# Altium project SJA1105Q_LAN8870_EVB_revA.PrjPcb (part 2 of 2)

## Sheet LAN8870_PINOUT.SchDoc
size C; SheetNumber: 3; SheetTotal: 7
Used 4 times, as channels PHY_1, PHY_2, PHY_3, PHY_4. Parts and nets are listed once, with the designators drawn on the sheet.
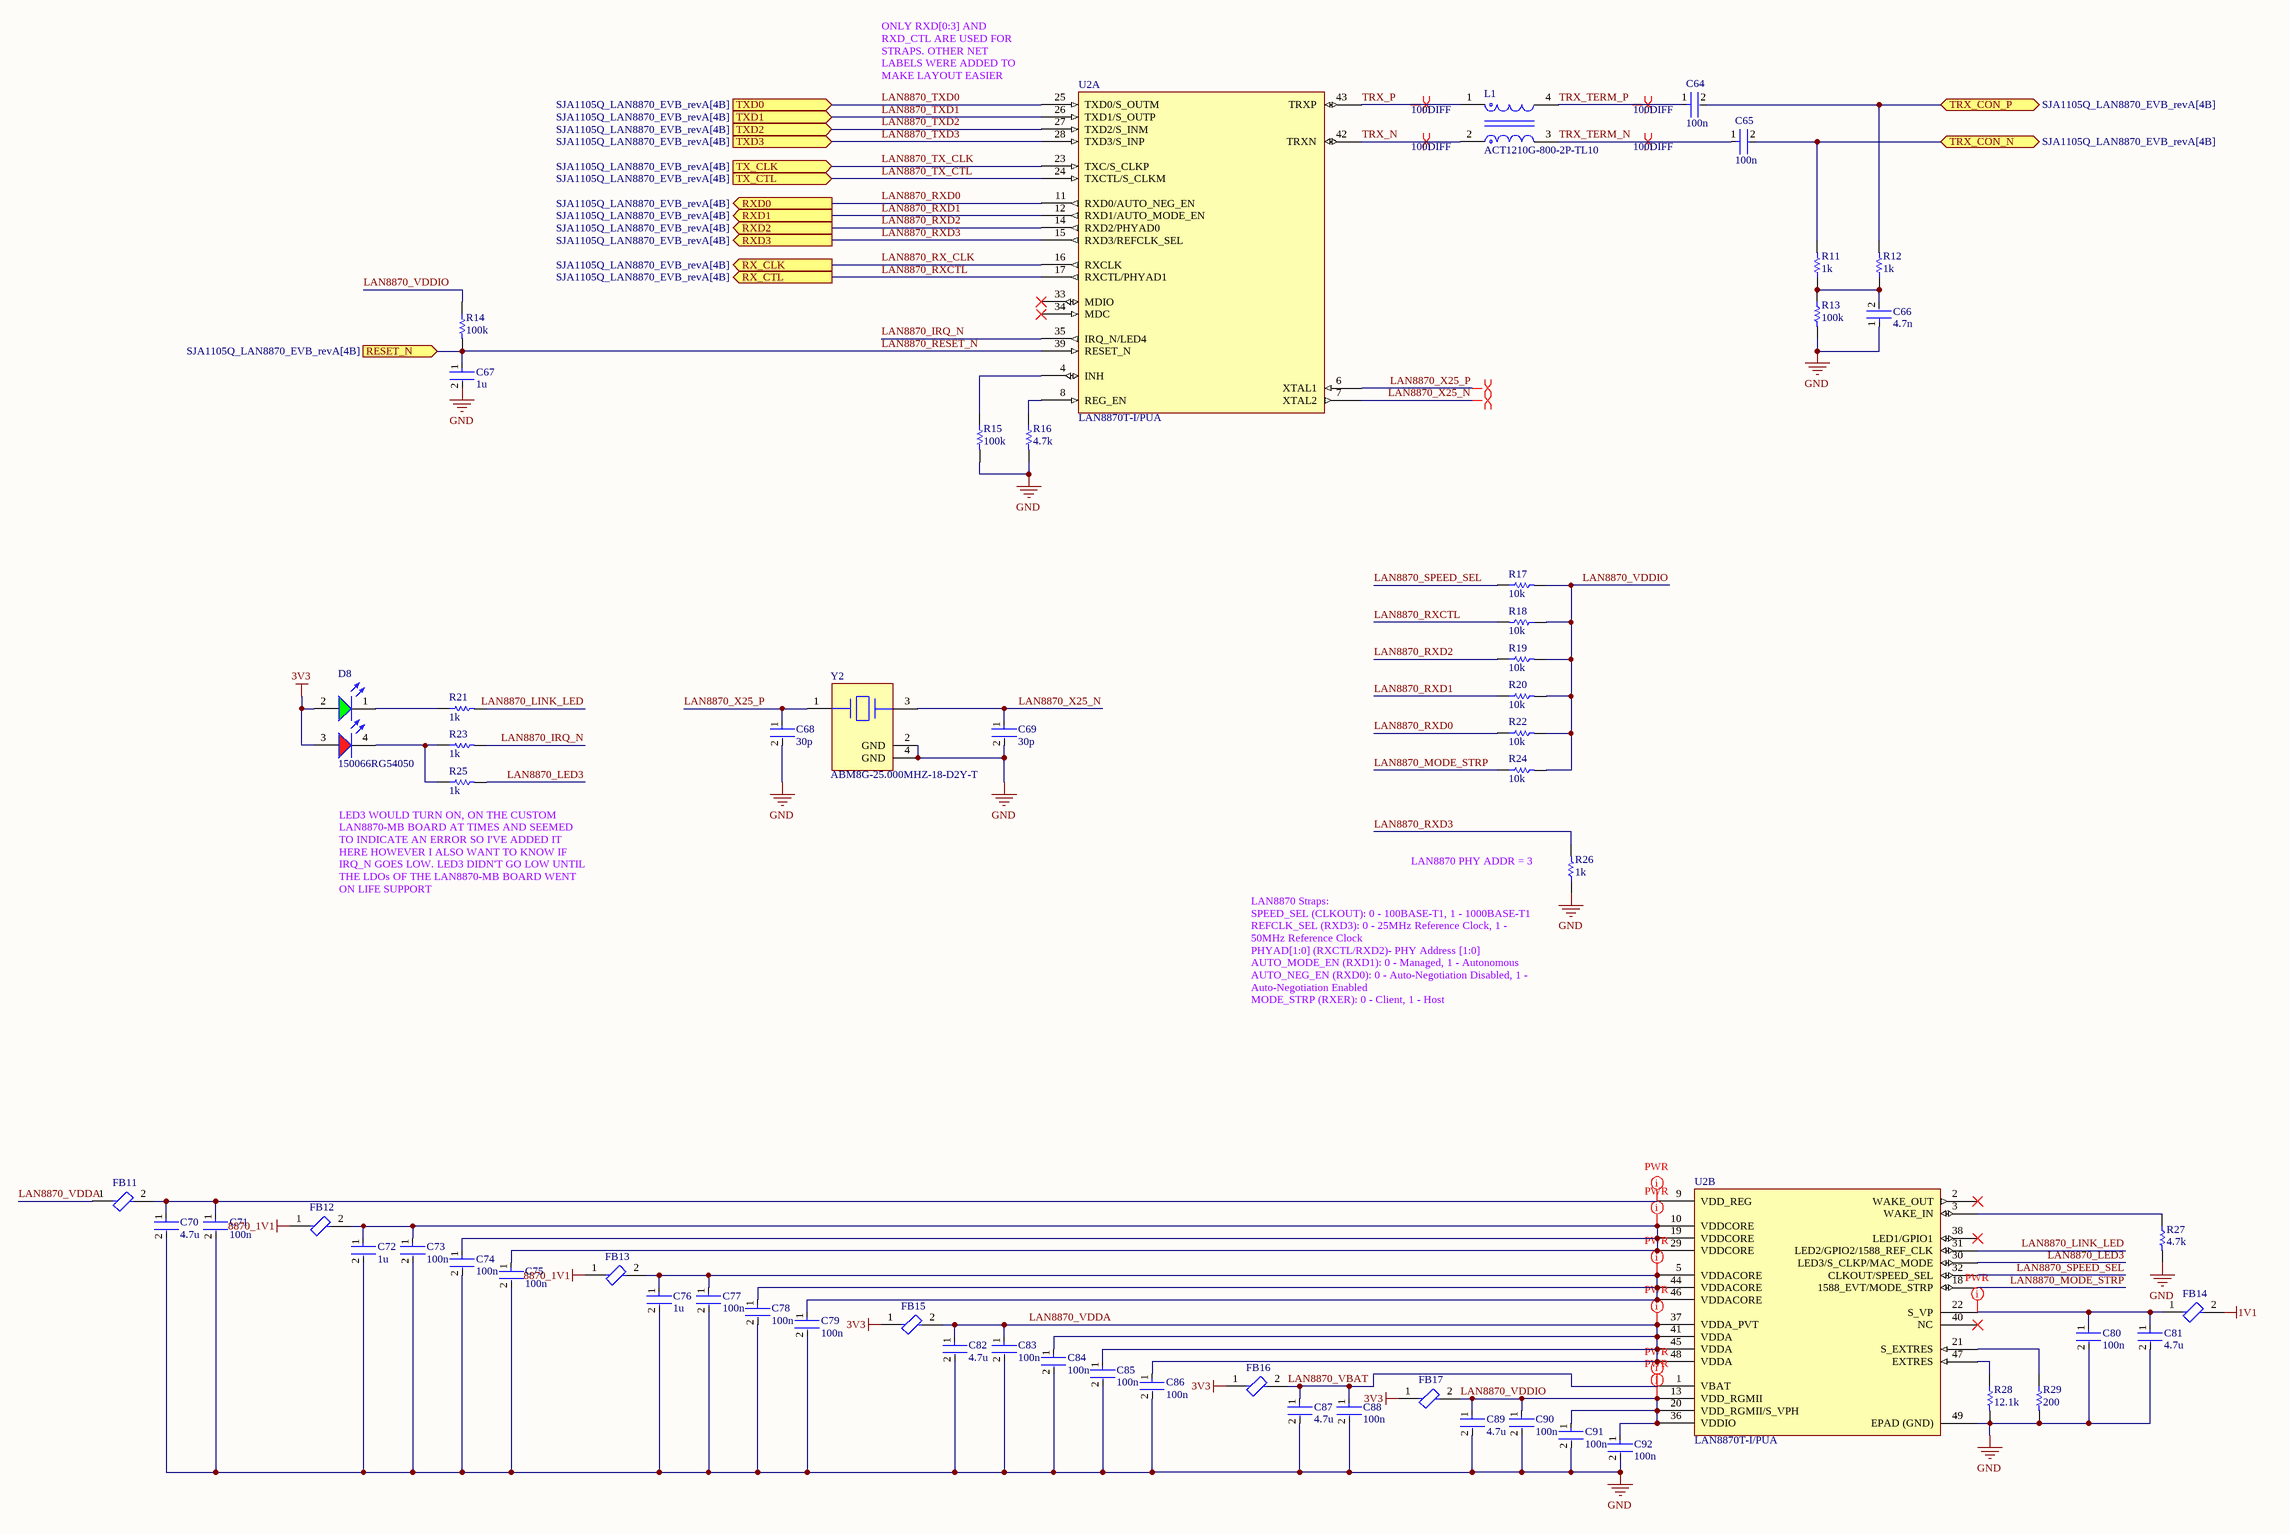
[diagram p8: LAN8870_PINOUT.SchDoc]

### Parts
C64  100n  [FP-0402-L_1_0_0_05-W_0_5-IPC_A]
C65  100n  [FP-0402-L_1_0_0_05-W_0_5-IPC_A]
C66  4.7n  [FP-0402-L_1_0_0_05-W_0_5-IPC_A]
C67  1u  [FP-0402-L_1_0_0_05-W_0_5-IPC_A]
C68  30p  [FP-0402-L_1_0_0_05-W_0_5-IPC_A]
C69  30p  [FP-0402-L_1_0_0_05-W_0_5-IPC_A]
C70  4.7u  [FP-0402-L_1_0_0_05-W_0_5-IPC_A]
C71  100n  [FP-0402-L_1_0_0_05-W_0_5-IPC_A]
C72  1u  [FP-0402-L_1_0_0_05-W_0_5-IPC_A]
C73  100n  [FP-0402-L_1_0_0_05-W_0_5-IPC_A]
C74  100n  [FP-0402-L_1_0_0_05-W_0_5-IPC_A]
C75  100n  [FP-0402-L_1_0_0_05-W_0_5-IPC_A]
C76  1u  [FP-0402-L_1_0_0_05-W_0_5-IPC_A]
C77  100n  [FP-0402-L_1_0_0_05-W_0_5-IPC_A]
C78  100n  [FP-0402-L_1_0_0_05-W_0_5-IPC_A]
C79  100n  [FP-0402-L_1_0_0_05-W_0_5-IPC_A]
C80  100n  [FP-0402-L_1_0_0_05-W_0_5-IPC_A]
C81  4.7u  [FP-0402-L_1_0_0_05-W_0_5-IPC_A]
C82  4.7u  [FP-0402-L_1_0_0_05-W_0_5-IPC_A]
C83  100n  [FP-0402-L_1_0_0_05-W_0_5-IPC_A]
C84  100n  [FP-0402-L_1_0_0_05-W_0_5-IPC_A]
C85  100n  [FP-0402-L_1_0_0_05-W_0_5-IPC_A]
C86  100n  [FP-0402-L_1_0_0_05-W_0_5-IPC_A]
C87  4.7u  [FP-0402-L_1_0_0_05-W_0_5-IPC_A]
C88  100n  [FP-0402-L_1_0_0_05-W_0_5-IPC_A]
C89  4.7u  [FP-0402-L_1_0_0_05-W_0_5-IPC_A]
C90  100n  [FP-0402-L_1_0_0_05-W_0_5-IPC_A]
C91  100n  [FP-0402-L_1_0_0_05-W_0_5-IPC_A]
C92  100n  [FP-0402-L_1_0_0_05-W_0_5-IPC_A]
D8  150066RG54050  [WL-SBCD_0606]
FB11  BLM18KG331SH1D  [FP-BLM18-0_15-t0_8-IPC_B]  (value not drawn)
FB12  BLM18KG331SH1D  [FP-BLM18-0_15-t0_8-IPC_B]  (value not drawn)
FB13  BLM18KG331SH1D  [FP-BLM18-0_15-t0_8-IPC_B]  (value not drawn)
FB14  BLM18KG331SH1D  [FP-BLM18-0_15-t0_8-IPC_B]  (value not drawn)
FB15  BLM18KG331SH1D  [FP-BLM18-0_15-t0_8-IPC_B]  (value not drawn)
FB16  BLM18KG331SH1D  [FP-BLM18-0_15-t0_8-IPC_B]  (value not drawn)
FB17  BLM18KG331SH1D  [FP-BLM18-0_15-t0_8-IPC_B]  (value not drawn)
L1  ACT1210G-800-2P-TL10  [FP-ACT1210G-800-2P-TL10-MFG]
R11  1k  [R0603B]
R12  1k  [R0603B]
R13  100k  [R0603B]
R14  100k  [R0603B]
R15  100k  [R0603B]
R16  4.7k  [R0603B]
R17  10k  [R0603B]
R18  10k  [R0603B]
R19  10k  [R0603B]
R20  10k  [R0603B]
R21  1k  [R0603B]
R22  10k  [R0603B]
R23  1k  [R0603B]
R24  10k  [R0603B]
R25  1k  [R0603B]
R26  1k  [R0603B]
R27  4.7k  [R0603B]
R28  12.1k  [R0603B]
R29  200  [R0603B]
U2  LAN8870T-I/PUA  [QFN50P700X700X100_HS-49N]  (parts A,B of 2)
Y2  ABM8G-25.000MHZ-18-D2Y-T  [FP-ABM8G-MFG]

### Ports
RESET_N (in, see SJA1105Q_LAN8870_EVB_revA[4B]), RX_CLK (out, see SJA1105Q_LAN8870_EVB_revA[4B]), RX_CTL (out, see SJA1105Q_LAN8870_EVB_revA[4B]), RXD0 (out, see SJA1105Q_LAN8870_EVB_revA[4B]), RXD1 (out, see SJA1105Q_LAN8870_EVB_revA[4B]), RXD2 (out, see SJA1105Q_LAN8870_EVB_revA[4B]), RXD3 (out, see SJA1105Q_LAN8870_EVB_revA[4B]), TRX_CON_N (bidir, see SJA1105Q_LAN8870_EVB_revA[4B]), TRX_CON_P (bidir, see SJA1105Q_LAN8870_EVB_revA[4B]), TX_CLK (in, see SJA1105Q_LAN8870_EVB_revA[4B]), TX_CTL (in, see SJA1105Q_LAN8870_EVB_revA[4B]), TXD0 (in, see SJA1105Q_LAN8870_EVB_revA[4B]), TXD1 (in, see SJA1105Q_LAN8870_EVB_revA[4B]), TXD2 (in, see SJA1105Q_LAN8870_EVB_revA[4B]), TXD3 (in, see SJA1105Q_LAN8870_EVB_revA[4B])

### Nets
1V1: FB14.2
3V3: D8.2(A) D8.3(A) FB15.1 FB16.1 FB17.1
8870_1V1: FB12.1 FB13.1
GND: C66.1 C67.2 C68.2 C69.2 C70.2 C71.2 C72.2 C73.2 C74.2 C75.2 C76.2 C77.2 C78.2 C79.2 C80.2 C81.2 C82.2 C83.2 C84.2 C85.2 C86.2 C87.2 C88.2 C89.2 C90.2 C91.2 C92.2 R13.2 R15.2 R16.2 R26.1 R27.2 R28.2 R29.2 U2.49(EPAD_(GND)) Y2.2(GND) Y2.4(GND)
LAN8870_IRQ_N: R23.2 U2.35(IRQ_N/LED4)
LAN8870_LED3: R25.2 U2.30(LED3/S_CLKP/MAC_MODE)
LAN8870_LINK_LED: R21.2 U2.31(LED2/GPIO2/1588_REF_CLK)
LAN8870_MODE_STRP: R24.1 U2.18(1588_EVT/MODE_STRP)
LAN8870_RESET_N: C67.1 R14.2 U2.39(RESET_N) ; port RESET_N
LAN8870_RX_CLK: U2.16(RXCLK) ; port RX_CLK
LAN8870_RXCTL: R18.2 U2.17(RXCTL/PHYAD1) ; port RX_CTL
LAN8870_RXD0: R22.1 U2.11(RXD0/AUTO_NEG_EN) ; port RXD0
LAN8870_RXD1: R20.1 U2.12(RXD1/AUTO_MODE_EN) ; port RXD1
LAN8870_RXD2: R19.1 U2.14(RXD2/PHYAD0) ; port RXD2
LAN8870_RXD3: R26.2 U2.15(RXD3/REFCLK_SEL) ; port RXD3
LAN8870_SPEED_SEL: R17.1 U2.32(CLKOUT/SPEED_SEL)
LAN8870_TX_CLK: U2.23(TXC/S_CLKP) ; port TX_CLK
LAN8870_TX_CTL: U2.24(TXCTL/S_CLKM) ; port TX_CTL
LAN8870_TXD0: U2.25(TXD0/S_OUTM) ; port TXD0
LAN8870_TXD1: U2.26(TXD1/S_OUTP) ; port TXD1
LAN8870_TXD2: U2.27(TXD2/S_INM) ; port TXD2
LAN8870_TXD3: U2.28(TXD3/S_INP) ; port TXD3
LAN8870_VBAT: C87.1 C88.1 FB16.2 U2.1(VBAT)
LAN8870_VDDA: C82.1 C83.1 C84.1 C85.1 C86.1 FB11.1 FB15.2 U2.37(VDDA_PVT) U2.41(VDDA) U2.45(VDDA) U2.48(VDDA)
LAN8870_VDDIO: C89.1 C90.1 C91.1 C92.1 FB17.2 R14.1 R17.2 R18.1 R19.2 R20.2 R22.2 R24.2 U2.13(VDD_RGMII) U2.20(VDD_RGMII/S_VPH) U2.36(VDDIO)
LAN8870_X25_N: C69.1 U2.7(XTAL2) Y2.3
LAN8870_X25_P: C68.1 U2.6(XTAL1) Y2.1
TRX_CON_N: C65.2 R11.2 ; port TRX_CON_N
TRX_CON_P: C64.2 R12.2 ; port TRX_CON_P
TRX_N: L1.2 U2.42(TRXN)
TRX_P: L1.1 U2.43(TRXP)
TRX_TERM_N: C65.1 L1.3
TRX_TERM_P: C64.1 L1.4
NetC66_2: C66.2 R11.1 R12.1 R13.1
NetC70_1: C70.1 C71.1 FB11.2 U2.9(VDD_REG)
NetC72_1: C72.1 C73.1 C74.1 C75.1 FB12.2 U2.10(VDDCORE) U2.19(VDDCORE) U2.29(VDDCORE)
NetC76_1: C76.1 C77.1 C78.1 C79.1 FB13.2 U2.5(VDDACORE) U2.44(VDDACORE) U2.46(VDDACORE)
NetC80_1: C80.1 C81.1 FB14.1 U2.22(S_VP)
NetD8_1: D8.1(K) R21.1
NetD8_4: D8.4(K) R23.1 R25.1
NetR15_1: R15.1 U2.4(INH)
NetR16_1: R16.1 U2.8(REG_EN)
NetR27_1: R27.1 U2.3(WAKE_IN)
NetR28_1: R28.1 U2.47(EXTRES)
NetR29_1: R29.1 U2.21(S_EXTRES)

Not connected (* = marked no-connect by the designer): U2 2(WAKE_OUT)* 33(MDIO)* 34(MDC)* 38(LED1/GPIO1)* 40(NC)*

### Channels
PHY_1: designators end in _PHY_1; ports RESET_N=3V3_LAN8870_0_nRST RX_CLK=LAN8870_RX_CLK RX_CTL=LAN8870_RXCTL RXD0=LAN8870_RXD0 RXD1=LAN8870_RXD1 RXD2=LAN8870_RXD2 RXD3=LAN8870_RXD3 TRX_CON_N=P1_TRX_N TRX_CON_P=P1_TRX_P TX_CLK=LAN8870_TX_CLK TX_CTL=LAN8870_TX_CTL TXD0=LAN8870_TXD0 TXD1=LAN8870_TXD1 TXD2=LAN8870_TXD2 TXD3=LAN8870_TXD3
PHY_2: designators end in _PHY_2; ports RESET_N=3V3_LAN8870_1_nRST RX_CLK=LAN8870_RX_CLK RX_CTL=LAN8870_RXCTL RXD0=LAN8870_RXD0 RXD1=LAN8870_RXD1 RXD2=LAN8870_RXD2 RXD3=LAN8870_RXD3 TRX_CON_N=P2_TRX_N TRX_CON_P=P2_TRX_P TX_CLK=LAN8870_TX_CLK TX_CTL=LAN8870_TX_CTL TXD0=LAN8870_TXD0 TXD1=LAN8870_TXD1 TXD2=LAN8870_TXD2 TXD3=LAN8870_TXD3
PHY_3: designators end in _PHY_3; ports RESET_N=3V3_LAN8870_2_nRST RX_CLK=LAN8870_RX_CLK RX_CTL=LAN8870_RXCTL RXD0=LAN8870_RXD0 RXD1=LAN8870_RXD1 RXD2=LAN8870_RXD2 RXD3=LAN8870_RXD3 TRX_CON_N=P3_TRX_N TRX_CON_P=P3_TRX_P TX_CLK=LAN8870_TX_CLK TX_CTL=LAN8870_TX_CTL TXD0=LAN8870_TXD0 TXD1=LAN8870_TXD1 TXD2=LAN8870_TXD2 TXD3=LAN8870_TXD3
PHY_4: designators end in _PHY_4; ports RESET_N=3V3_LAN8870_3_nRST RX_CLK=LAN8870_RX_CLK RX_CTL=LAN8870_RXCTL RXD0=LAN8870_RXD0 RXD1=LAN8870_RXD1 RXD2=LAN8870_RXD2 RXD3=LAN8870_RXD3 TRX_CON_N=P4_TRX_N TRX_CON_P=P4_TRX_P TX_CLK=LAN8870_TX_CLK TX_CTL=LAN8870_TX_CTL TXD0=LAN8870_TXD0 TXD1=LAN8870_TXD1 TXD2=LAN8870_TXD2 TXD3=LAN8870_TXD3

### Layout directives
differential pair; differential pair class 100DIFF: TRX_N_PHY_1, TRX_P_PHY_1, TRX_TERM_N_PHY_1, TRX_TERM_P_PHY_1
differential pair: LAN8870_X25_N_PHY_1, LAN8870_X25_P_PHY_1
net class PWR: LAN8870_VBAT_PHY_1, LAN8870_VDDA_PHY_1, LAN8870_VDDIO_PHY_1, NetC70_PHY_1_1, NetC72_PHY_1_1, NetC76_PHY_1_1, NetC80_PHY_1_1

### Notes on the sheet
- ONLY RXD[0:3] AND RXD_CTL ARE USED FOR STRAPS. OTHER NET LABELS WERE ADDED TO MAKE LAYOUT EASIER
- LAN8870 PHY ADDR = 3
- (near R25) LED3 WOULD TURN ON, ON THE CUSTOM LAN8870-MB BOARD AT TIMES AND SEEMED TO INDICATE AN ERROR SO I'VE ADDED IT HERE HOWEVER I ALSO WANT TO KNOW IF IRQ_N GOES LOW. LED3 DIDN'T GO LOW UNTIL THE LDOs OF THE LAN8870-MB BOARD WENT ON LIFE SUPPORT
- (near R26) LAN8870 Straps:
  SPEED_SEL (CLKOUT): 0 - 100BASE-T1, 1 - 1000BASE-T1
  REFCLK_SEL (RXD3): 0 - 25MHz Reference Clock, 1 - 50MHz Reference Clock
  PHYAD[1:0] (RXCTL/RXD2)- PHY Address [1:0]
  AUTO_MODE_EN (RXD1): 0 - Managed, 1 - Autonomous
  AUTO_NEG_EN (RXD0): 0 - Auto-Negotiation Disabled, 1 - Auto-Negotiation Enabled
  MODE_STRP (RXER): 0 - Client, 1 - Host

### Library data of the parts
C64-C92 = CMP-001-00058-1: as C1 on sheet SJA1105Q_LAN8870_EVB_revA; Min Operating Temperature: -55°C; Mounting Technology: Surface Mount; Pins: 2; Case/Package: 0402; RoHS Compliant: Yes; Max Operating Temperature: 85°C
D8 = CMP-004-00040-2: Led, Red/Grn, 180Mcd/230Mcd, 624Nm/525Nm Rohs Compliant: Yes; Source: rgled.SchLib; Component Type: Standard; Design Item ID: CMP-004-00034-2; Pins: 4
FB11-FB17 = CMP-06046-002069-1: as FB1 on sheet SJA1105Q_PINOUT; Packaging: Tape and Reel; Case/Package: 0603; Height: 0.037inch; Case Code (Metric): 1608; Length: 0.063inch; Package Quantity: 4000; Max Operating Temperature: 125°C; Case Code (Imperial): 0603; RoHS Compliant: Yes; Width: 0.032inch; Mount: Surface Mount; Min Operating Temperature: -55°C; Ratings: AEC-Q200; Max Current Rating: 1.7A
L1 = CMP-08256-000023-1: CMC 80UH 70MA 2LN 3.8KOHM SMD
R11 R12 R16-R29 = CMP-009-00002-14: Resistor; Value: 100k
R13-R15 = CMP-009-00002-14: Resistor; Value: 100k
U2 = CMP-015-00023-5: 100/1000BASE-T1 Rgmii/sgmii Phy; Case/Package: VQFN; Pins: 48
Y2 = CMP-2000-05733-3: as Y1 on sheet SJA1105Q_PINOUT; Length: 3.2mm; Depth: 2.5mm; Packaging: Tape and Reel; Min Operating Temperature: -40°C; Operating Frequency: 25 MHz; Lead Free: Lead Free; Number of Pins: 4; Frequency Tolerance: 20ppm; Radiation Hardening: No; Max Operating Temperature: 85°C; Termination: SMD/SMT; Frequency Stability: 30ppm; Frequency: 25MHz; Series: ABM8G; Mount: Surface Mount; Package Quantity: 1000; Height: 0.039inch; Width: 0.098inch; Case/Package: CSMD; ESR (Equivalent Series Resistance): 60R; Load Capacitance: 18pF; Tolerance: 20ppm

## Sheet LAN8830_PINOUT.SchDoc
size C; SheetNumber: 4; SheetTotal: 7
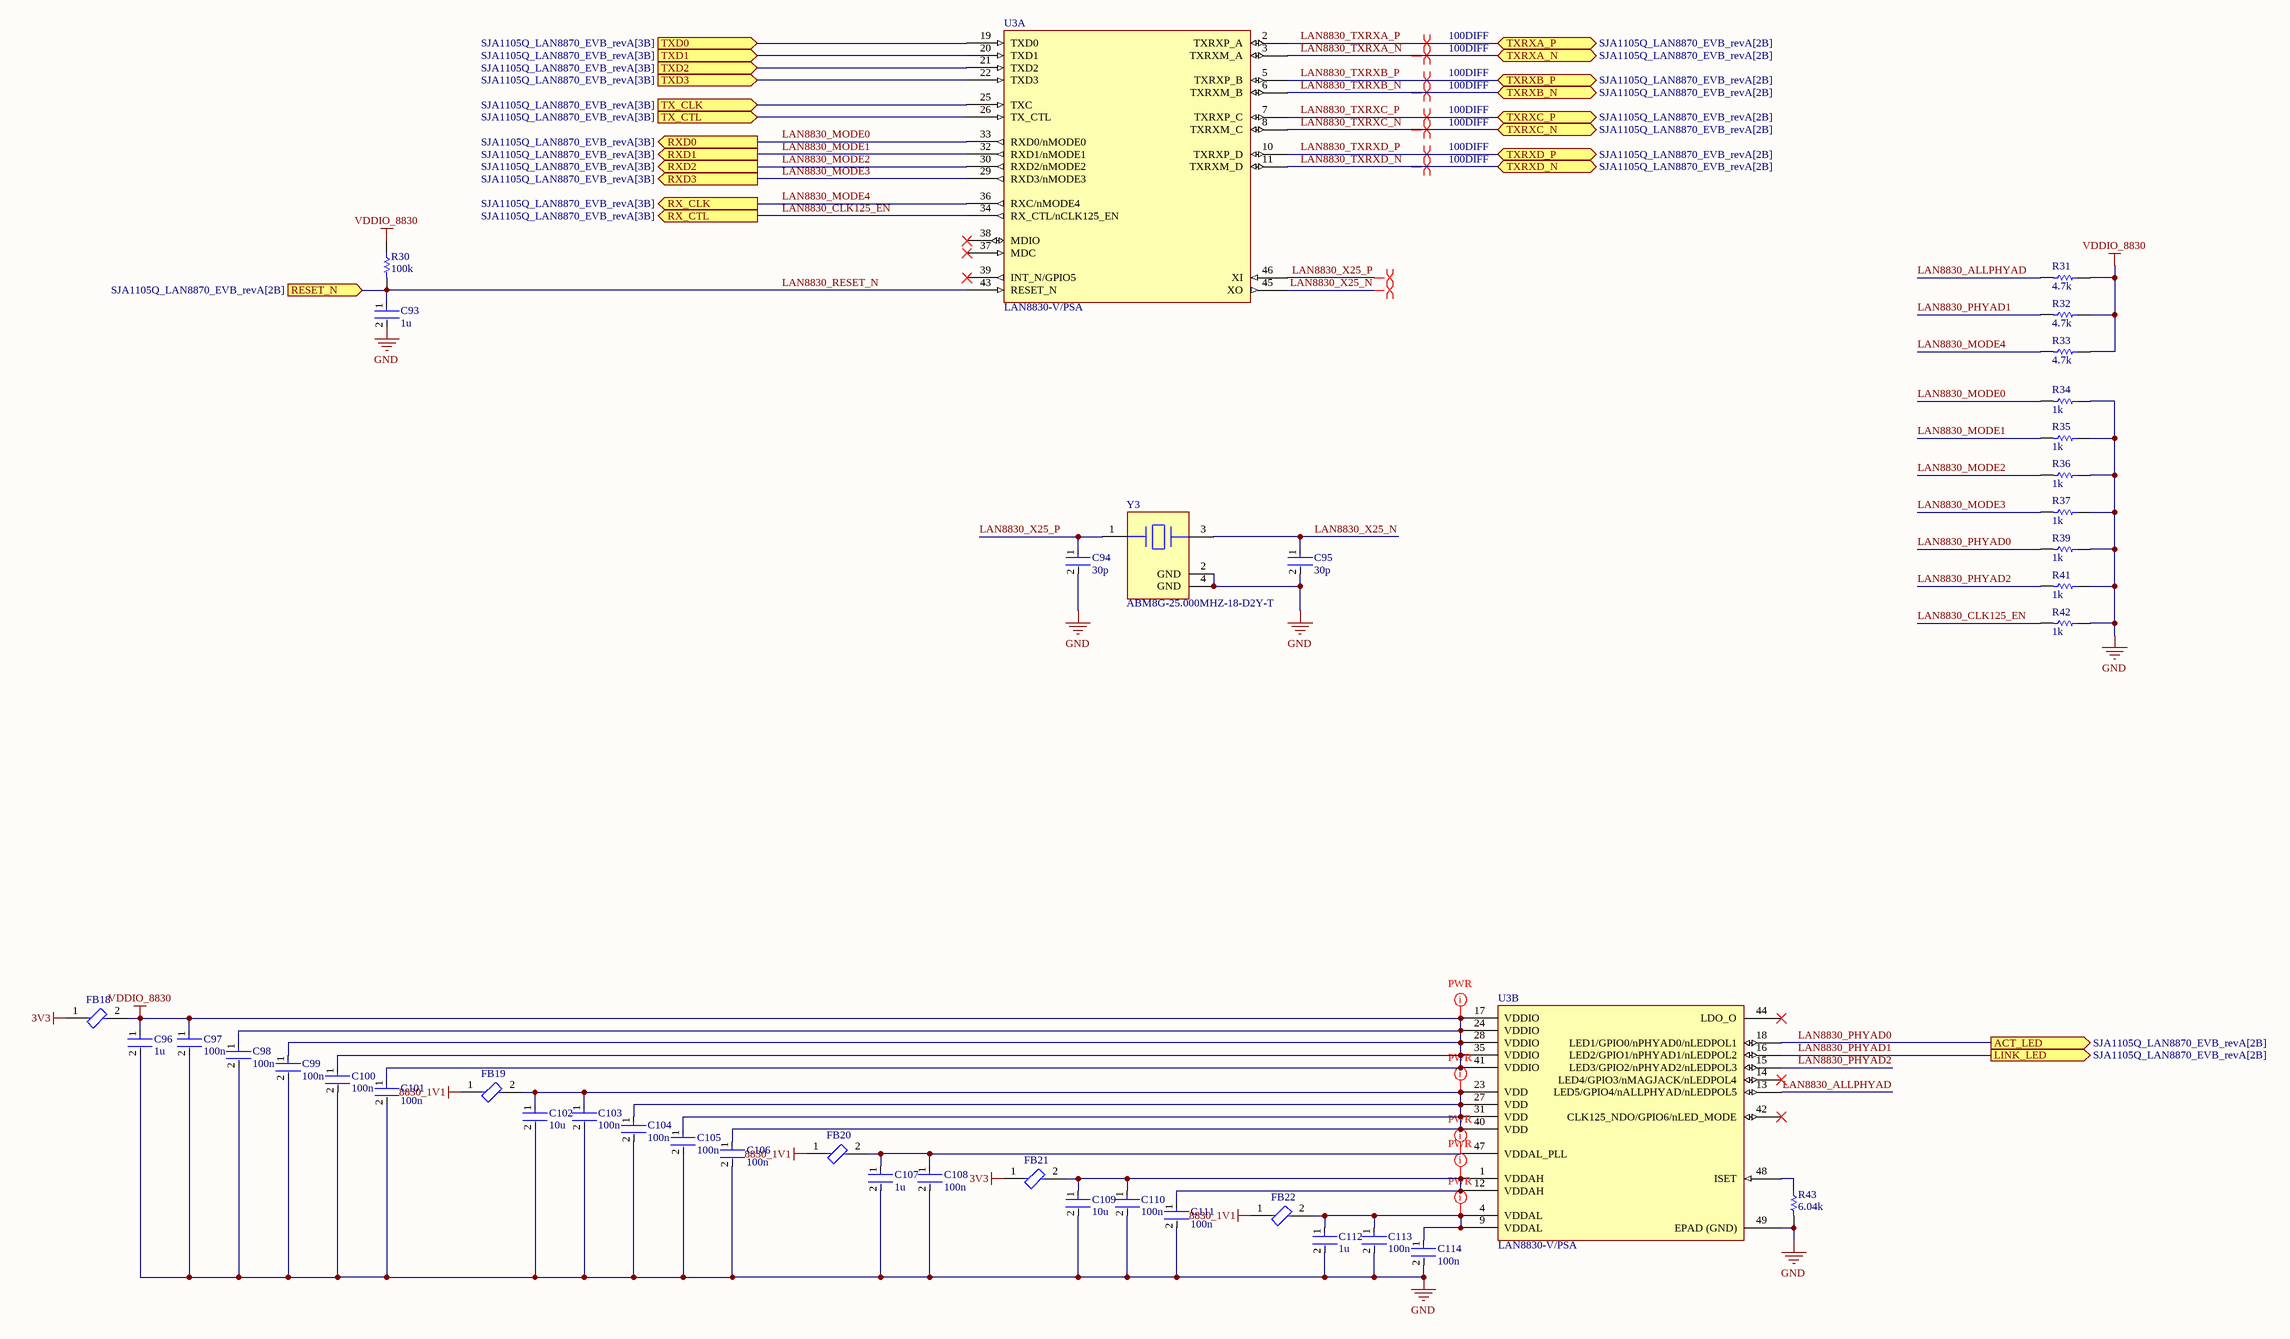
[diagram p9: LAN8830_PINOUT.SchDoc]

### Parts
C93  1u  [FP-0402-L_1_0_0_05-W_0_5-IPC_A]
C94  30p  [FP-0402-L_1_0_0_05-W_0_5-IPC_A]
C95  30p  [FP-0402-L_1_0_0_05-W_0_5-IPC_A]
C96  1u  [FP-0402-L_1_0_0_05-W_0_5-IPC_A]
C97  100n  [FP-0402-L_1_0_0_05-W_0_5-IPC_A]
C98  100n  [FP-0402-L_1_0_0_05-W_0_5-IPC_A]
C99  100n  [FP-0402-L_1_0_0_05-W_0_5-IPC_A]
C100  100n  [FP-0402-L_1_0_0_05-W_0_5-IPC_A]
C101  100n  [FP-0402-L_1_0_0_05-W_0_5-IPC_A]
C102  10u  [FP-0402-L_1_0_0_05-W_0_5-IPC_A]
C103  100n  [FP-0402-L_1_0_0_05-W_0_5-IPC_A]
C104  100n  [FP-0402-L_1_0_0_05-W_0_5-IPC_A]
C105  100n  [FP-0402-L_1_0_0_05-W_0_5-IPC_A]
C106  100n  [FP-0402-L_1_0_0_05-W_0_5-IPC_A]
C107  1u  [FP-0402-L_1_0_0_05-W_0_5-IPC_A]
C108  100n  [FP-0402-L_1_0_0_05-W_0_5-IPC_A]
C109  10u  [FP-0402-L_1_0_0_05-W_0_5-IPC_A]
C110  100n  [FP-0402-L_1_0_0_05-W_0_5-IPC_A]
C111  100n  [FP-0402-L_1_0_0_05-W_0_5-IPC_A]
C112  1u  [FP-0402-L_1_0_0_05-W_0_5-IPC_A]
C113  100n  [FP-0402-L_1_0_0_05-W_0_5-IPC_A]
C114  100n  [FP-0402-L_1_0_0_05-W_0_5-IPC_A]
FB18  BLM18KG331SH1D  [FP-BLM18-0_15-t0_8-IPC_B]  (value not drawn)
FB19  BLM18KG331SH1D  [FP-BLM18-0_15-t0_8-IPC_B]  (value not drawn)
FB20  BLM18KG331SH1D  [FP-BLM18-0_15-t0_8-IPC_B]  (value not drawn)
FB21  BLM18KG331SH1D  [FP-BLM18-0_15-t0_8-IPC_B]  (value not drawn)
FB22  BLM18KG331SH1D  [FP-BLM18-0_15-t0_8-IPC_B]  (value not drawn)
R30  100k  [R0603B]
R31  4.7k  [R0603B]
R32  4.7k  [R0603B]
R33  4.7k  [R0603B]
R34  1k  [R0603B]
R35  1k  [R0603B]
R36  1k  [R0603B]
R37  1k  [R0603B]
R39  1k  [R0603B]
R41  1k  [R0603B]
R42  1k  [R0603B]
R43  6.04k  [R0603B]
U3  LAN8830-V/PSA  [QFN50P700X700X100_HS-49N]  (parts A,B of 2)
Y3  ABM8G-25.000MHZ-18-D2Y-T  [FP-ABM8G-MFG]

### Ports
ACT_LED (out, see SJA1105Q_LAN8870_EVB_revA[2B]), LINK_LED (out, see SJA1105Q_LAN8870_EVB_revA[2B]), RESET_N (in, see SJA1105Q_LAN8870_EVB_revA[2B]), RX_CLK (out, see SJA1105Q_LAN8870_EVB_revA[3B]), RX_CTL (out, see SJA1105Q_LAN8870_EVB_revA[3B]), RXD0 (out, see SJA1105Q_LAN8870_EVB_revA[3B]), RXD1 (out, see SJA1105Q_LAN8870_EVB_revA[3B]), RXD2 (out, see SJA1105Q_LAN8870_EVB_revA[3B]), RXD3 (out, see SJA1105Q_LAN8870_EVB_revA[3B]), TX_CLK (in, see SJA1105Q_LAN8870_EVB_revA[3B]), TX_CTL (in, see SJA1105Q_LAN8870_EVB_revA[3B]), TXD0 (in, see SJA1105Q_LAN8870_EVB_revA[3B]), TXD1 (in, see SJA1105Q_LAN8870_EVB_revA[3B]), TXD2 (in, see SJA1105Q_LAN8870_EVB_revA[3B]), TXD3 (in, see SJA1105Q_LAN8870_EVB_revA[3B]), TXRXA_N (bidir, see SJA1105Q_LAN8870_EVB_revA[2B]), TXRXA_P (bidir, see SJA1105Q_LAN8870_EVB_revA[2B]), TXRXB_N (bidir, see SJA1105Q_LAN8870_EVB_revA[2B]), TXRXB_P (bidir, see SJA1105Q_LAN8870_EVB_revA[2B]), TXRXC_N (bidir, see SJA1105Q_LAN8870_EVB_revA[2B]), TXRXC_P (bidir, see SJA1105Q_LAN8870_EVB_revA[2B]), TXRXD_N (bidir, see SJA1105Q_LAN8870_EVB_revA[2B]), TXRXD_P (bidir, see SJA1105Q_LAN8870_EVB_revA[2B])

### Nets
3V3: FB18.1 FB21.1
8830_1V1: FB19.1 FB20.1 FB22.1
GND: C93.2 C94.2 C95.2 C96.2 C97.2 C98.2 C99.2 C100.2 C101.2 C102.2 C103.2 C104.2 C105.2 C106.2 C107.2 C108.2 C109.2 C110.2 C111.2 C112.2 C113.2 C114.2 R34.1 R35.1 R36.1 R37.1 R39.1 R41.1 R42.1 R43.2 U3.49(EPAD_(GND)) Y3.2(GND) Y3.4(GND)
VDDIO_8830: C96.1 C97.1 C98.1 C99.1 C100.1 C101.1 FB18.2 R30.1 R31.1 R32.1 R33.1 U3.17(VDDIO) U3.24(VDDIO) U3.28(VDDIO) U3.35(VDDIO) U3.41(VDDIO)
LAN8830_ALLPHYAD: R31.2 U3.13(LED5/GPIO4/nALLPHYAD/nLEDPOL5)
LAN8830_CLK125_EN: R42.2 U3.34(RX_CTL/nCLK125_EN) ; port RX_CTL
LAN8830_MODE0: R34.2 U3.33(RXD0/nMODE0) ; port RXD0
LAN8830_MODE1: R35.2 U3.32(RXD1/nMODE1) ; port RXD1
LAN8830_MODE2: R36.2 U3.30(RXD2/nMODE2) ; port RXD2
LAN8830_MODE3: R37.2 U3.29(RXD3/nMODE3) ; port RXD3
LAN8830_MODE4: R33.2 U3.36(RXC/nMODE4) ; port RX_CLK
LAN8830_PHYAD0: R39.2 U3.18(LED1/GPIO0/nPHYAD0/nLEDPOL1) ; port ACT_LED
LAN8830_PHYAD1: R32.2 U3.16(LED2/GPIO1/nPHYAD1/nLEDPOL2) ; port LINK_LED
LAN8830_PHYAD2: R41.2 U3.15(LED3/GPIO2/nPHYAD2/nLEDPOL3)
LAN8830_RESET_N: C93.1 R30.2 U3.43(RESET_N) ; port RESET_N  [project net 3V3_LAN8830_nRST]
LAN8830_TXRXA_N: U3.3(TXRXM_A) ; port TXRXA_N
LAN8830_TXRXA_P: U3.2(TXRXP_A) ; port TXRXA_P
LAN8830_TXRXB_N: U3.6(TXRXM_B) ; port TXRXB_N
LAN8830_TXRXB_P: U3.5(TXRXP_B) ; port TXRXB_P
LAN8830_TXRXC_N: U3.8(TXRXM_C) ; port TXRXC_N
LAN8830_TXRXC_P: U3.7(TXRXP_C) ; port TXRXC_P
LAN8830_TXRXD_N: U3.11(TXRXM_D) ; port TXRXD_N
LAN8830_TXRXD_P: U3.10(TXRXP_D) ; port TXRXD_P
LAN8830_X25_N: C95.1 U3.45(XO) Y3.3
LAN8830_X25_P: C94.1 U3.46(XI) Y3.1
NetC102_1: C102.1 C103.1 C104.1 C105.1 C106.1 FB19.2 U3.23(VDD) U3.27(VDD) U3.31(VDD) U3.40(VDD)
NetC107_1: C107.1 C108.1 FB20.2 U3.47(VDDAL_PLL)
NetC109_1: C109.1 C110.1 C111.1 FB21.2 U3.1(VDDAH) U3.12(VDDAH)
NetC112_1: C112.1 C113.1 C114.1 FB22.2 U3.4(VDDAL) U3.9(VDDAL)
NetR38_1: U3.19(TXD0) ; port TXD0
NetR40_1: U3.20(TXD1) ; port TXD1
NetR43_1: R43.1 U3.48(ISET)
NetR55_1: U3.21(TXD2) ; port TXD2
NetR56_1: U3.22(TXD3) ; port TXD3
NetR57_1: U3.25(TXC) ; port TX_CLK
NetR58_1: U3.26(TX_CTL) ; port TX_CTL

Not connected (* = marked no-connect by the designer): U3 14(LED4/GPIO3/nMAGJACK/nLEDPOL4)* 37(MDC)* 38(MDIO)* 39(INT_N/GPIO5)* 42(CLK125_NDO/GPIO6/nLED_MODE)* 44(LDO_O)*

### Layout directives
differential pair; differential pair class 100DIFF: LAN8830_TXRXA_N, LAN8830_TXRXA_P, LAN8830_TXRXB_N, LAN8830_TXRXB_P, LAN8830_TXRXC_N, LAN8830_TXRXC_P, LAN8830_TXRXD_N, LAN8830_TXRXD_P
differential pair: LAN8830_X25_N, LAN8830_X25_P
net class PWR: NetC102_1, NetC107_1, NetC109_1, NetC112_1, VDDIO_8830

### Library data of the parts
C93-C114 = CMP-001-00058-1: LARGE PADS, 0402 CAP, CHANGE COMMENT TO MATCH REAL P/N; Capacitor Type: Ceramic; Min Operating Temperature: -55°C; Mounting Technology: Surface Mount; Pins: 2; Case/Package: 0402; RoHS Compliant: Yes; Max Operating Temperature: 85°C
FB18-FB22 = CMP-06046-002069-1: Chip Ferrite Bead, 0603, 330Ω @ 100MHz, 0.08Ω, 25%, 1.7A; Number of Lines: 1; DC Resistance (DCR): 80mR; Packaging: Tape and Reel; Case/Package: 0603; Height: 0.037inch; Case Code (Metric): 1608; Length: 0.063inch; Package Quantity: 4000; Max Operating Temperature: 125°C; Case Code (Imperial): 0603; RoHS Compliant: Yes; Width: 0.032inch; Mount: Surface Mount; Min Operating Temperature: -55°C; Ratings: AEC-Q200; Max Current Rating: 1.7A
R30-R37 R39 R41-R43 = CMP-009-00002-14: Resistor
  R30: Value: 100k
  R31-R33: Value: 4.7k
  R34-R37 R39 R41 R42: Value: 1k
  R43: Value: 6.04k
U3 = CMP-015-00022-5: LAN8830 Series RGMII Interface Gigabit Ethernet Transceiver - VQFN-48; Case/Package: VQFN; Pins: 48
Y3 = CMP-2000-05733-3: Crystal 25MHz ±20ppm (Tol) ±30ppm (Stability) 18pF FUND 60Ω 4-Pin SMD T/R; Series Resistance: 60R; Length: 3.2mm; Depth: 2.5mm; Packaging: Tape and Reel; Min Operating Temperature: -40°C; Operating Frequency: 25 MHz; Lead Free: Lead Free; Number of Pins: 4; Frequency Tolerance: 20ppm; Radiation Hardening: No; Max Operating Temperature: 85°C; Termination: SMD/SMT; Frequency Stability: 30ppm; Frequency: 25MHz; Series: ABM8G; Mount: Surface Mount; Package Quantity: 1000; Height: 0.039inch; Width: 0.098inch; Case/Package: CSMD; ESR (Equivalent Series Resistance): 60R; Load Capacitance: 18pF; Tolerance: 20ppm

## Sheet LM61495Q3_PINOUT.SchDoc
size A4; SheetNumber: 6; SheetTotal: 7
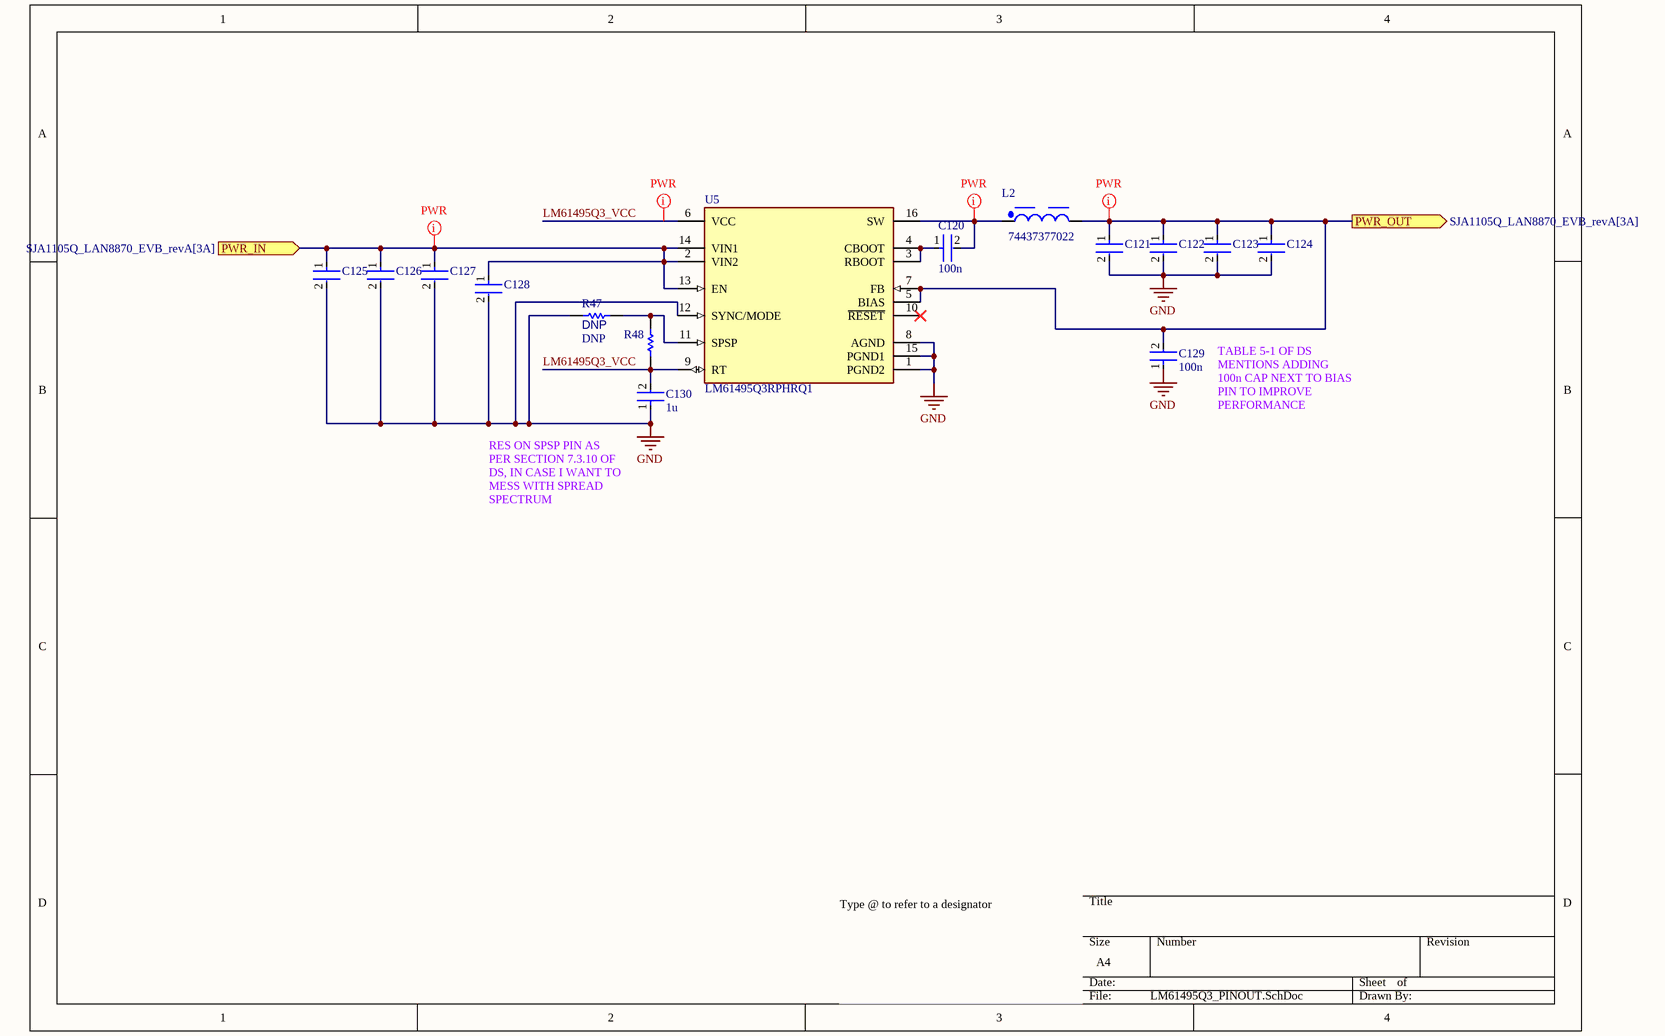
[diagram p10: LM61495Q3_PINOUT.SchDoc]

### Parts
C120  100n  [FP-0402-L_1_0_0_05-W_0_5-IPC_A]
C121  GRM32ER61C476KE15L  [FP-GRM32E-0_3-0_2-IPC_C]  (value not drawn)
C122  GRM32ER61C476KE15L  [FP-GRM32E-0_3-0_2-IPC_C]  (value not drawn)
C123  GRM32ER61C476KE15L  [FP-GRM32E-0_3-0_2-IPC_C]  (value not drawn)
C124  DNP  [FP-GRM32E-0_3-0_2-IPC_C]  (value not drawn)
C125  C3225X7R1H106M250AC  [FP-C3225-250-0_4-MFG]  (value not drawn)
C126  C3225X7R1H106M250AC  [FP-C3225-250-0_4-MFG]  (value not drawn)
C127  08055C474J4Z2A  [FP-0805-L_2_01_0_2-W_1_25-IPC_B]  (value not drawn)
C128  08055C474J4Z2A  [FP-0805-L_2_01_0_2-W_1_25-IPC_B]  (value not drawn)
C129  100n  [FP-0402-L_1_0_0_05-W_0_5-IPC_A]
C130  1u  [FP-0402-L_1_0_0_05-W_0_5-IPC_A]
L2  74437377022  [WE-LHMI_1335]
R47  DNP  [R0603B]
R48  0402 JUMPER  [RESC1005X40X25ML05T05]  (value not drawn)
U5  LM61495Q3RPHRQ1  [FP-RPH0016A-MFG]

### Ports
PWR_IN (in, see SJA1105Q_LAN8870_EVB_revA[3A]), PWR_OUT (out, see SJA1105Q_LAN8870_EVB_revA[3A])

### Nets
3V3: C121.1 C122.1 C123.1 C124.1 C129.2 L2.2 U5.5(BIAS) U5.7(FB) ; port PWR_OUT
GND: C121.2 C122.2 C123.2 C124.2 C125.2 C126.2 C127.2 C128.2 C129.1 C130.1 R47.2 U5.1(PGND2) U5.8(AGND) U5.12(SYNC/MODE) U5.15(PGND1)
VCC: C125.1 C126.1 C127.1 C128.1 U5.2(VIN2) U5.13(EN) U5.14(VIN1) ; port PWR_IN
LM61495Q3_VCC: C130.2 R48.1 U5.6(VCC) U5.9(RT)
NetC120_1: C120.1 U5.3(RBOOT) U5.4(CBOOT)
NetC120_2: C120.2 L2.1 U5.16(SW)
NetR47_1: R47.1 R48.2 U5.11(SPSP)

Not connected (* = marked no-connect by the designer): U5 10(~{RESET})*

### Layout directives
net class PWR: 3V3, LM61495Q3_VCC, NetC120_2, VCC

### Notes on the sheet
- TABLE 5-1 OF DS MENTIONS ADDING 100n CAP NEXT TO BIAS PIN TO IMPROVE PERFORMANCE
- (near C130) RES ON SPSP PIN AS PER SECTION 7.3.10 OF DS, IN CASE I WANT TO MESS WITH SPREAD SPECTRUM
- Type @ to refer to a designator

### Library data of the parts
C120 C129 C130 = CMP-001-00058-1: as C93-C114 on sheet LAN8830_PINOUT; Min Operating Temperature: -55°C; Mounting Technology: Surface Mount; Pins: 2; Case/Package: 0402; RoHS Compliant: Yes; Max Operating Temperature: 85°C
C121-C124 = CMP-2000-06362-2: CAP CER 47UF 16V X5R 1210; Tolerance: 10%; Material: Ceramic; Case Code (Metric): 3225; RoHS Compliant: Yes; Min Operating Temperature: -55°C; Radiation Hardening: No; Voltage: 16V; Package Quantity: 1; Case Code (Imperial): 1210; REACH SVHC: No SVHC; Capacitance: 47uF; Voltage Rating (DC): 16V; Dielectric: X5R; Case/Package: 1210; Length: 3.2mm; Voltage Rating: 16V; Packaging: Cut Tape; Width: 0.098inch; Number of Pins: 2; Lead Free: Lead Free; Height: 2.5mm; Mount: Surface Mount; Termination: SMD/SMT; Max Operating Temperature: 85°C; Thickness: 0.106inch; Depth: 2.5mm
C125 C126 = CMP-08246-002653-1: Multilayer Ceramic Capacitors 10uF ±20% 50V X7R SMD 1210; Width: 0.098inch; Package Quantity: 1000; Height: 2.5mm; Dielectric Material: Ceramic; Voltage Rating: 50V; Series: C; Capacitance: 10uF; Tolerance: 20%; Weight: 0.000564oz; Case/Package: 1210; Case Code (Imperial): 1210; Dielectric: X7R; Case Code (Metric): 3225; REACH SVHC: No SVHC; Packaging: Tape and Reel; Length: 0.126inch; Termination: SMD/SMT; Min Operating Temperature: -55°C; Voltage Rating (DC): 50V; Lead Free: Lead Free; Max Operating Temperature: 125°C; Thickness: 0.11inch; Mount: Surface Mount
C127 C128 = CMP-04427-003155-1: Automotive Ceramic Capacitor, 0805, 470nF, 5%, X7R, 15%, 50V; Dielectric: X7R; Depth: 1.25mm; Max Operating Temperature: 125°C; Mount: Surface Mount; Radiation Hardening: No; Capacitance: 470nF; Construction: Flat; Packaging: Tape and Reel; Min Operating Temperature: -55°C; Length: 2.01mm; RoHS Compliant: Yes; Voltage Rating (DC): 50V; Case/Package: 0805; Tolerance: 5%; Package Quantity: 2000
L2 = CMP-1353-00019-6: Inductor Power Shielded/Molded Wirewound 2.2uH 20% 100KHz Powdered Iron 10A 0.008Ohm DCR T/R Automotive AEC-Q200; Series Resistance: 8mΩ; DC Resistance (DCR): 7.2mΩ; Inductance: 2.2µH; Saturation Current: 14.2A; Core Material: Composite, Ferrite; Frequency: 22MHz; Mount: Surface Mount; Ambient Temperature Range Low: -40°C; Max DC Current: 10A; Depth: 12.6mm; Height: 3.3mm; Tolerance: 20%; REACH SVHC: Unknown; Width: 12.6mm; Max Operating Temperature: 125°C; Height - Seated (Max): 3.5052mm; Composition: Wirewound; Inductance Tolerance: 20%; Length: 13.5mm; RMS Current (Irms): 10A; Termination: SMD/SMT; Test Frequency: 100kHz; Current Rating: 10A; Case/Package: Nonstandard; Shielding: Shielded; Ambient Temperature Range High: 85°C; Min Operating Temperature: -40°C; Self Resonant Frequency: 22MHz; RoHS: Compliant
R47 = CMP-009-00002-14: Resistor; Value: DNP
R48 = CMP-009-00118-2: READ THE NAME; Pins: 2; Component Type: Standard; Design Item ID: CMP-009-00206-2; Source: 0402jump.SchLib
U5 = CMP-04918-000675-1: 10-A AUTOMOTIVE BUCK CONVERTER O

## Sheet MCP1726_PINOUT.SchDoc
size A; SheetNumber: 5; SheetTotal: 7
Used 3 times, as channels REG_1, REG_2, REG_3. Parts and nets are listed once, with the designators drawn on the sheet.
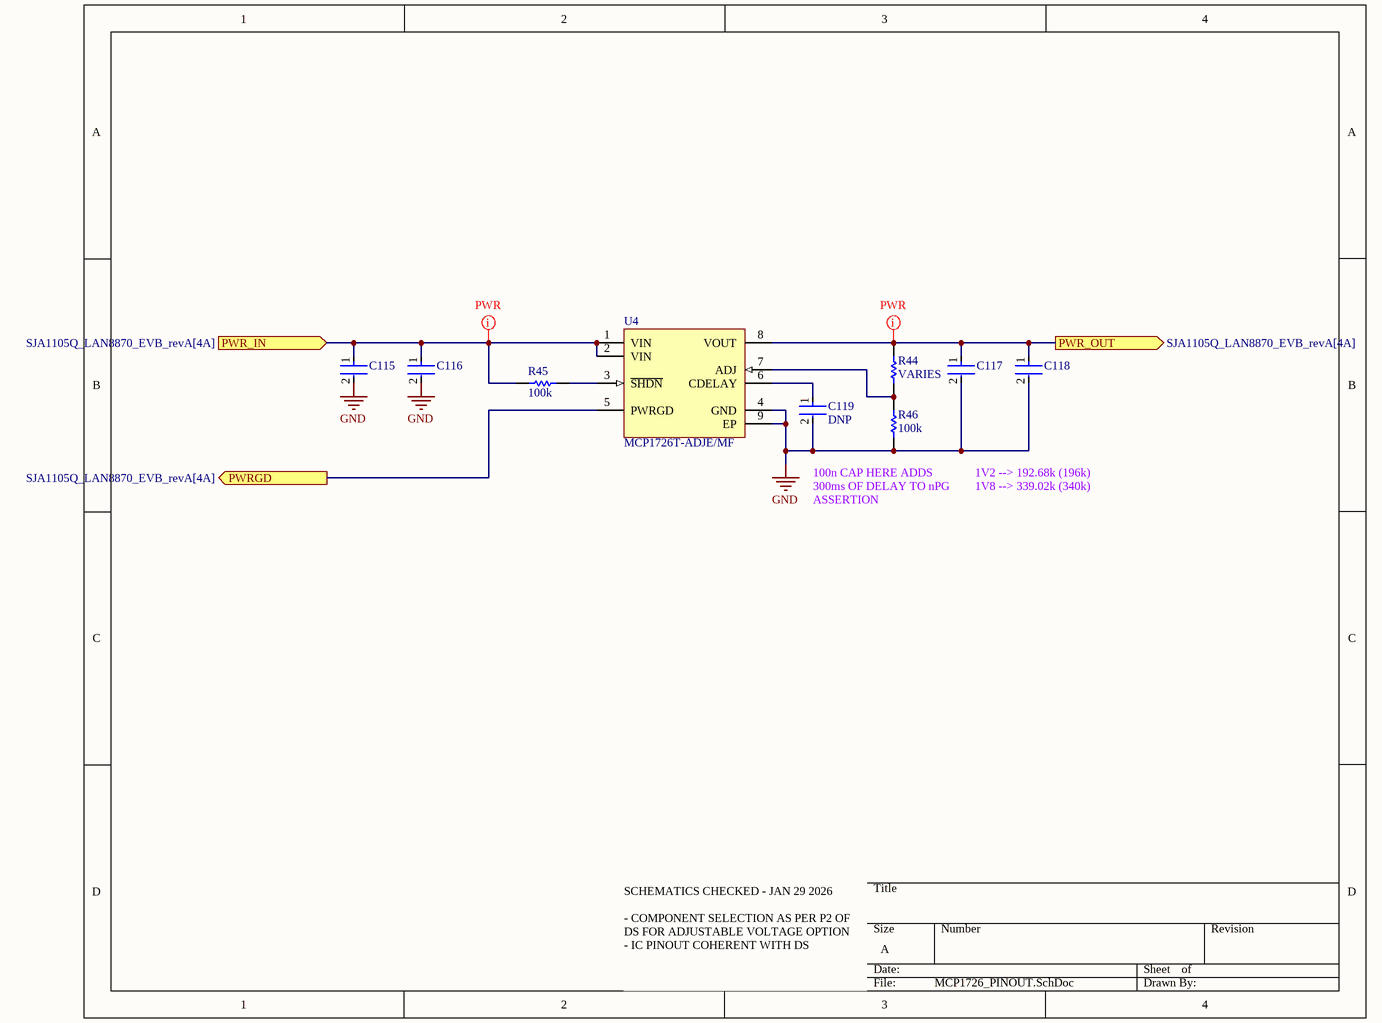
[diagram p11: MCP1726_PINOUT.SchDoc]

### Parts
C115  C0805C475J4RACAUTO  [FP-C0805C475J4RACAUTO-MFG]  (value not drawn)
C116  DNP  [FP-C0805C475J4RACAUTO-MFG]  (value not drawn)
C117  HMK325B7105KN-T  [FP-1210-L_3_2_0_3-W_2_5_0-IPC_B]  (value not drawn)
C118  DNP  [FP-1210-L_3_2_0_3-W_2_5_0-IPC_B]  (value not drawn)
C119  DNP  [FP-0402-L_1_0_0_05-W_0_5-IPC_A]
R44  VARIES  [R0603B]
R45  100k  [R0603B]
R46  100k  [R0603B]
U4  MCP1726T-ADJE/MF  [DFN-MF8]

### Ports
PWR_IN (in, see SJA1105Q_LAN8870_EVB_revA[4A]), PWR_OUT (out, see SJA1105Q_LAN8870_EVB_revA[4A]), PWRGD (out, see SJA1105Q_LAN8870_EVB_revA[4A])

### Nets
GND: C115.2 C116.2 C117.2 C118.2 C119.2 R46.1 U4.4(GND) U4.9(EP)
PWR_IN: C115.1 C116.1 R45.1 U4.1(VIN) U4.2(VIN) ; port PWR_IN
PWR_OUT: C117.1 C118.1 R44.2 U4.8(VOUT) ; port PWR_OUT
PWRGD: U4.5(PWRGD) ; port PWRGD
NetC119_1: C119.1 U4.6(CDELAY)
NetR44_1: R44.1 R46.2 U4.7(ADJ)
NetR45_2: R45.2 U4.3(~{SHDN})

### Channels
REG_1: designators end in _REG_1#1; ports PWR_IN=3V3 PWR_OUT=1V2 PWRGD=NetU4_REG_1#1_5
REG_2: designators end in _REG_1#2; ports PWR_IN=3V3 PWR_OUT=8830_1V1 PWRGD=NetU4_REG_1#2_5
REG_3: designators end in _REG_3; ports PWR_IN=3V3 PWR_OUT=8870_1V1 PWRGD=NetU4_REG_3_5

### Layout directives
net class PWR: 1V2, 3V3

### Notes on the sheet
- (near R46) 100n CAP HERE ADDS 300ms OF DELAY TO nPG ASSERTION
- 1V2 --> 192.68k (196k)
  1V8 --> 339.02k (340k)
- SCHEMATICS CHECKED - JAN 29 2026
  - COMPONENT SELECTION AS PER P2 OF DS FOR ADJUSTABLE VOLTAGE OPTION
  - IC PINOUT COHERENT WITH DS

### Library data of the parts
C115 C116 = CMP-00212-84766729-1: C0805C475J4RACAUTO Cap Ceramic 4.7uF 16V X7R 5% Pad SMD 0805 125C Automotive T/R; Capacitance: 4.7µF; Max Operating Temperature: 125°C; Dielectric Material: Ceramic; Voltage Rating (DC): 16V; Dielectric: X7R; Height: 1.4mm; Case/Package: 0805; NexarPartId: 84766729; Voltage Rating: 16V; RoHS: Compliant; Material: Ceramic; Packaging: Cut Tape; Tolerance: 5%; Min Operating Temperature: -55°C
C117 C118 = CMP-14477-002774-2: None; Dielectric: X5R; Capacitance: 1uF; Voltage Rating (DC): 100V; Tolerance: 10%; Length: 3.2mm; Thickness: 0.083inch; Construction: Flat; Width: 2.5mm; Number of Pins: 2; Height: 1.9mm; REACH SVHC: No SVHC; Case Code (Metric): 3225; Termination: SMD/SMT; Packaging: Tape and Reel; Resistor Type: Ceramic; Mount: Surface Mount; Radiation Hardening: No; Case/Package: 1210; Case Code (Imperial): 1210; Min Operating Temperature: -55°C; Max Operating Temperature: 125°C; Halogen Free: Halogen Free; Voltage Rating: 100V; Depth: 2.5mm; Package Quantity: 1; RoHS Compliant: Yes; Voltage: 100V; Series: M
C119 = CMP-001-00058-1: as C93-C114 on sheet LAN8830_PINOUT; Min Operating Temperature: -55°C; Mounting Technology: Surface Mount; Pins: 2; Case/Package: 0402; RoHS Compliant: Yes; Max Operating Temperature: 85°C
R44 R45 = CMP-009-00002-14: Resistor
  R44: Value: VARIES
  R45: Value: 100k
R46 = CMP-009-00002-14: Resistor; Value: 10k
U4 = CMP-0136-00358-1: 1A, Low Voltage, Low Quiescent Current LDO Regulator, 8-Pin DFN, Extended Temperature, Tape and Reel; DatasheetVersion: revC, Aug-2007; PackageDescription: 8-Lead Plastic Dual Flat, No Lead Package (MF) - 3x3x0.9mm Body [DFN]; PackageVersion: revBB, Aug-2009; PackageReference: DFN-MF8

## Sheet STM32G473RET6_PINOUT.SchDoc
size B; SheetNumber: 7; SheetTotal: 7
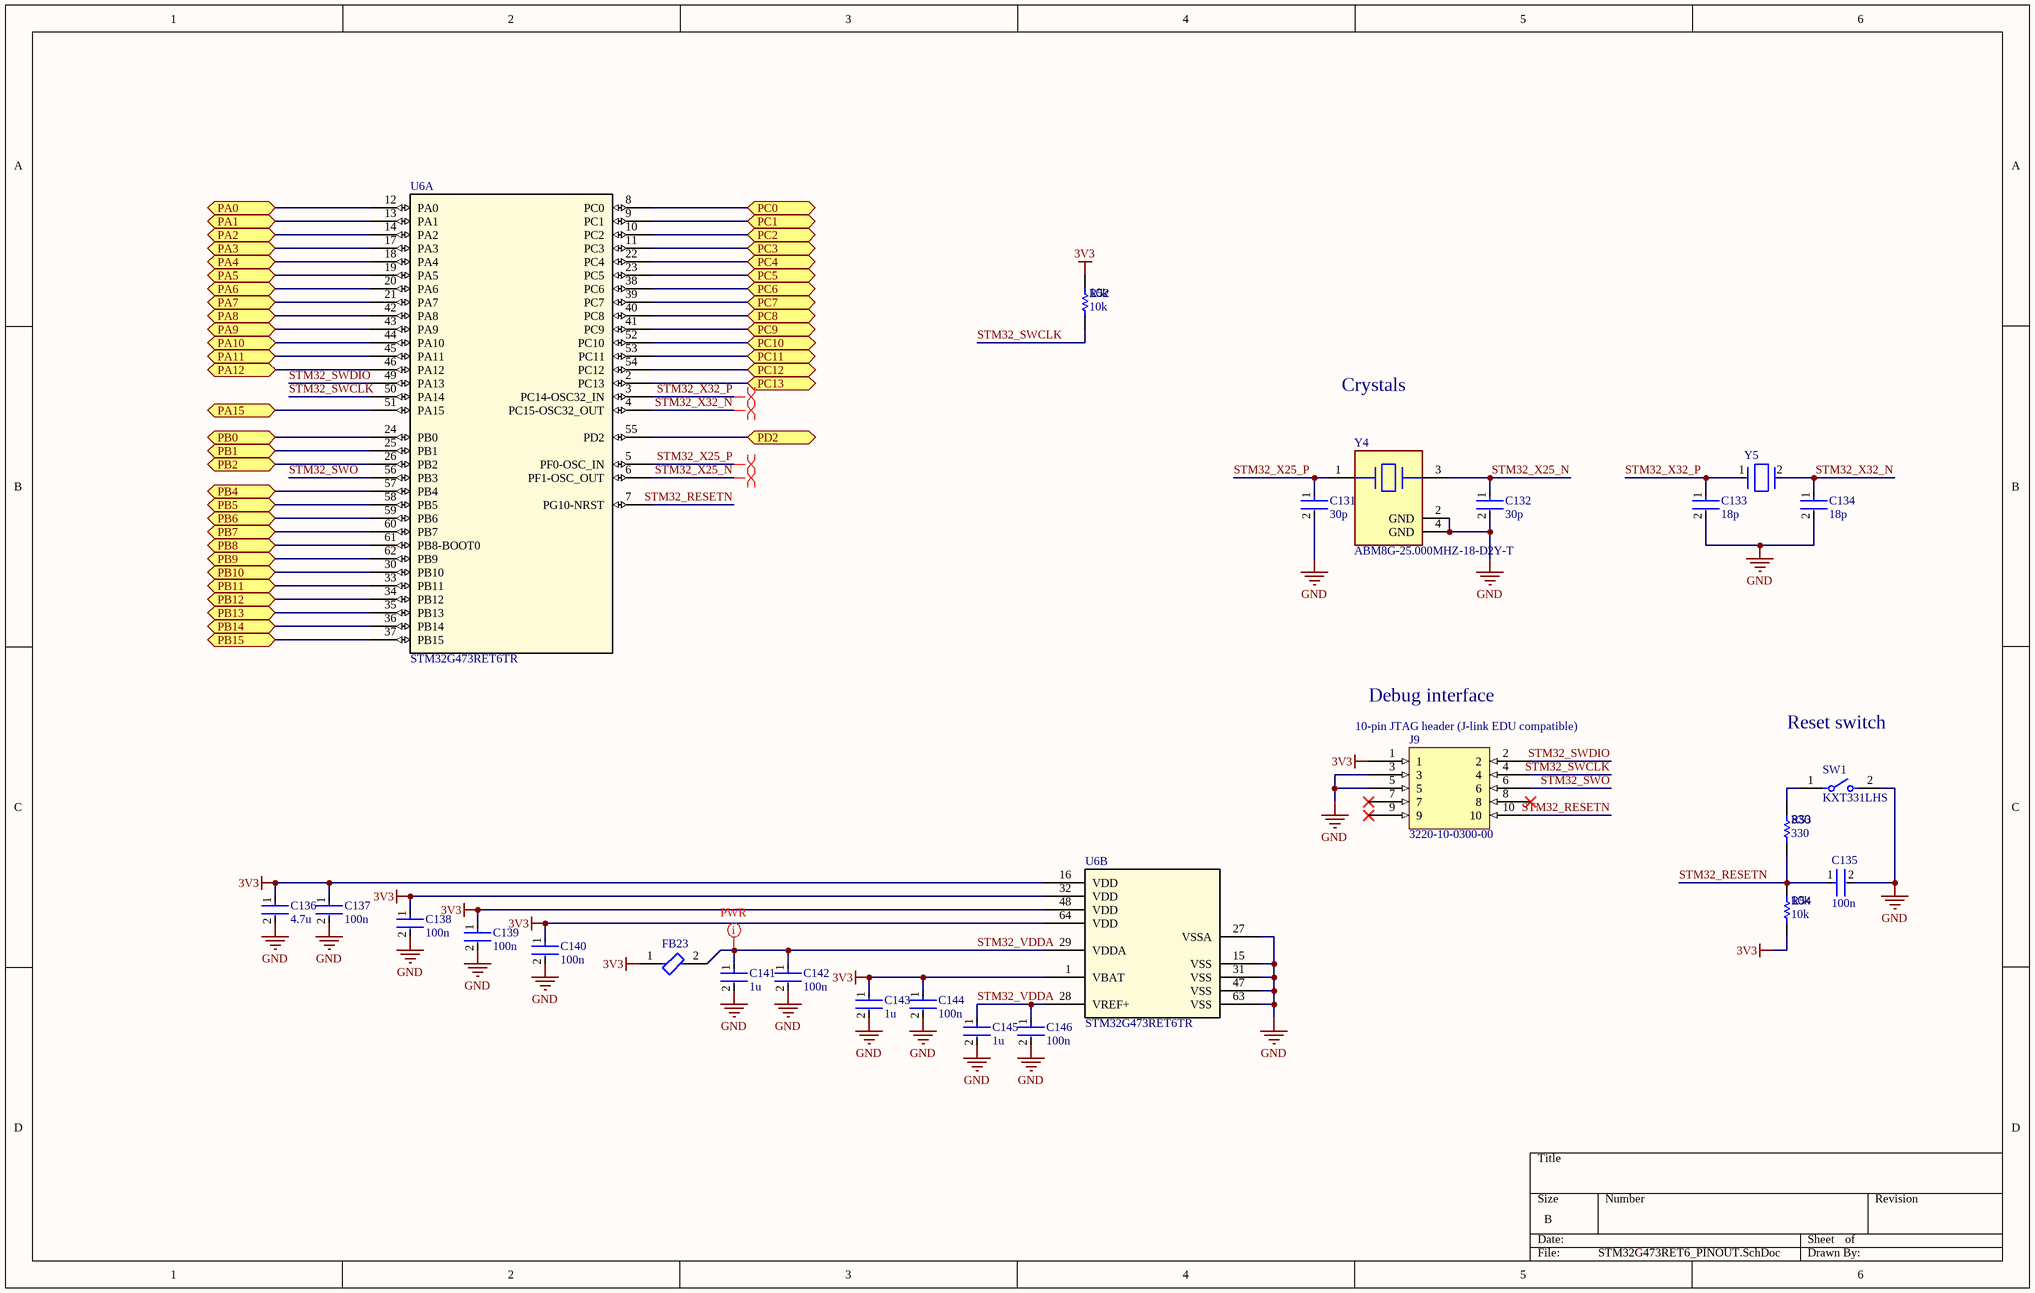
[diagram p12: STM32G473RET6_PINOUT.SchDoc]

### Parts
C131  30p  [FP-0402-L_1_0_0_05-W_0_5-IPC_A]
C132  30p  [FP-0402-L_1_0_0_05-W_0_5-IPC_A]
C133  18p  [FP-0402-L_1_0_0_05-W_0_5-IPC_A]
C134  18p  [FP-0402-L_1_0_0_05-W_0_5-IPC_A]
C135  100n  [FP-0402-L_1_0_0_05-W_0_5-IPC_A]
C136  4.7u  [FP-0402-L_1_0_0_05-W_0_5-IPC_A]
C137  100n  [FP-0402-L_1_0_0_05-W_0_5-IPC_A]
C138  100n  [FP-0402-L_1_0_0_05-W_0_5-IPC_A]
C139  100n  [FP-0402-L_1_0_0_05-W_0_5-IPC_A]
C140  100n  [FP-0402-L_1_0_0_05-W_0_5-IPC_A]
C141  1u  [FP-0402-L_1_0_0_05-W_0_5-IPC_A]
C142  100n  [FP-0402-L_1_0_0_05-W_0_5-IPC_A]
C143  1u  [FP-0402-L_1_0_0_05-W_0_5-IPC_A]
C144  100n  [FP-0402-L_1_0_0_05-W_0_5-IPC_A]
C145  1u  [FP-0402-L_1_0_0_05-W_0_5-IPC_A]
C146  100n  [FP-0402-L_1_0_0_05-W_0_5-IPC_A]
FB23  BLM18KG331SH1D  [FP-BLM18-0_15-t0_8-IPC_B]  (value not drawn)
J9  3220-10-0300-00  [3220-10-0300-00-Footprint-1]
R52  10k  [R0603B]
R53  330  [R0603B]
R54  10k  [R0603B]
SW1  KXT331LHS  [FP-KXT331LHS-MFG]
U6  STM32G473RET6TR  [STM32G473RET6TR-Footprint-1]  (parts A,B of 2)
Y4  ABM8G-25.000MHZ-18-D2Y-T  [FP-ABM8G-MFG]
Y5  ECS-.327-12.5-1210-TR  [FP-ECX-1210-MFG]  (value not drawn)

### Ports
PA0 (bidir), PA1 (bidir), PA2 (bidir), PA3 (bidir), PA4 (bidir), PA5 (bidir), PA6 (bidir), PA7 (bidir), PA8 (bidir), PA9 (bidir), PA10 (bidir), PA11 (bidir), PA12 (bidir), PA15 (bidir), PB0 (bidir), PB1 (bidir), PB2 (bidir), PB4 (bidir), PB5 (bidir), PB6 (bidir), PB7 (bidir), PB8 (bidir), PB9 (bidir), PB10 (bidir), PB11 (bidir), PB12 (bidir), PB13 (bidir), PB14 (bidir), PB15 (bidir), PC0 (bidir), PC1 (bidir), PC2 (bidir), PC3 (bidir), PC4 (bidir), PC5 (bidir), PC6 (bidir), PC7 (bidir), PC8 (bidir), PC9 (bidir), PC10 (bidir), PC11 (bidir), PC12 (bidir), PC13 (bidir), PD2 (bidir)

### Nets
3V3: C136.1 C137.1 C138.1 C139.1 C140.1 C143.1 C144.1 FB23.1 J9.1 R52.2 R54.1 U6.1(VBAT) U6.16(VDD) U6.32(VDD) U6.48(VDD) U6.64(VDD)
GND: C131.2 C132.2 C133.2 C134.2 C135.2 C136.2 C137.2 C138.2 C139.2 C140.2 C141.2 C142.2 C143.2 C144.2 C145.2 C146.2 J9.3 J9.5 SW1.2 U6.15(VSS) U6.27(VSSA) U6.31(VSS) U6.47(VSS) U6.63(VSS) Y4.2(GND) Y4.4(GND)
3V3_SJA1150Q_MISO: U6.20(PA6) ; port PA6
3V3_SJA1150Q_MOSI: U6.21(PA7) ; port PA7
3V3_SJA1150Q_nCS: U6.18(PA4) ; port PA4
3V3_SJA1150Q_nRST: U6.22(PC4) ; port PC4
3V3_SJA1150Q_SCLK: U6.19(PA5) ; port PA5
STM32_G_LED: U6.61(PB8-BOOT0) ; port PB8
STM32_R_LED: U6.62(PB9) ; port PB9
STM32_RESETN: C135.1 J9.10 R53.1 R54.2 U6.7(PG10-NRST)
STM32_SWCLK: J9.4 R52.1 U6.50(PA14)
STM32_SWDIO: J9.2 U6.49(PA13)
STM32_SWO: J9.6 U6.56(PB3)
STM32_VDDA: C141.1 C142.1 C145.1 C146.1 FB23.2 U6.28(VREF+) U6.29(VDDA)
STM32_X25_N: C132.1 U6.6(PF1-OSC_OUT) Y4.3
STM32_X25_P: C131.1 U6.5(PF0-OSC_IN) Y4.1
STM32_X32_N: C134.1 U6.4(PC15-OSC32_OUT) Y5.2(Out/In)
STM32_X32_P: C133.1 U6.3(PC14-OSC32_IN) Y5.1(In/Out)
NetR53_2: R53.2 SW1.1
NetU6_2: U6.2(PC13) ; port PC13
NetU6_8: U6.8(PC0) ; port PC0
NetU6_9: U6.9(PC1) ; port PC1
NetU6_10: U6.10(PC2) ; port PC2
NetU6_11: U6.11(PC3) ; port PC3
NetU6_12: U6.12(PA0) ; port PA0
NetU6_13: U6.13(PA1) ; port PA1
NetU6_14: U6.14(PA2) ; port PA2
NetU6_17: U6.17(PA3) ; port PA3
NetU6_23: U6.23(PC5) ; port PC5
NetU6_24: U6.24(PB0) ; port PB0
NetU6_25: U6.25(PB1) ; port PB1
NetU6_26: U6.26(PB2) ; port PB2
NetU6_30: U6.30(PB10) ; port PB10
NetU6_33: U6.33(PB11) ; port PB11
NetU6_34: U6.34(PB12) ; port PB12
NetU6_35: U6.35(PB13) ; port PB13
NetU6_36: U6.36(PB14) ; port PB14
NetU6_37: U6.37(PB15) ; port PB15
NetU6_38: U6.38(PC6) ; port PC6
NetU6_39: U6.39(PC7) ; port PC7
NetU6_40: U6.40(PC8) ; port PC8
NetU6_41: U6.41(PC9) ; port PC9
NetU6_42: U6.42(PA8) ; port PA8
NetU6_43: U6.43(PA9) ; port PA9
NetU6_44: U6.44(PA10) ; port PA10
NetU6_45: U6.45(PA11) ; port PA11
NetU6_46: U6.46(PA12) ; port PA12
NetU6_51: U6.51(PA15) ; port PA15
NetU6_52: U6.52(PC10) ; port PC10
NetU6_53: U6.53(PC11) ; port PC11
NetU6_54: U6.54(PC12) ; port PC12
NetU6_55: U6.55(PD2) ; port PD2
NetU6_57: U6.57(PB4) ; port PB4
NetU6_58: U6.58(PB5) ; port PB5
NetU6_59: U6.59(PB6) ; port PB6
NetU6_60: U6.60(PB7) ; port PB7

Not connected (* = marked no-connect by the designer): J9 7* 8* 9*

### Layout directives
differential pair: STM32_X25_N, STM32_X25_P, STM32_X32_N, STM32_X32_P
net class PWR: STM32_VDDA

### Notes on the sheet
- Crystals
- Debug interface
- (near J9) 10-pin JTAG header (J-link EDU compatible)
- Reset switch

### Library data of the parts
C131-C146 = CMP-001-00058-1: as C93-C114 on sheet LAN8830_PINOUT; Min Operating Temperature: -55°C; Mounting Technology: Surface Mount; Pins: 2; Case/Package: 0402; RoHS Compliant: Yes; Max Operating Temperature: 85°C
  C131 C132: Value: 30p
  C133 C134: Value: 18p
  C135 C137-C140 C142 C144 C146: Value: 100n
  C136: Value: 4.7u
  C141 C143 C145: Value: 1u
FB23 = CMP-06046-002069-1: as FB18-FB22 on sheet LAN8830_PINOUT; Packaging: Tape and Reel; Case/Package: 0603; Height: 0.037inch; Case Code (Metric): 1608; Length: 0.063inch; Package Quantity: 4000; Max Operating Temperature: 125°C; Case Code (Imperial): 0603; RoHS Compliant: Yes; Width: 0.032inch; Mount: Surface Mount; Min Operating Temperature: -55°C; Ratings: AEC-Q200; Max Current Rating: 1.7A
J9 = CMP-001-0013-3: CONN HEADER SMD 10POS 1.27MM
R52-R54 = CMP-009-00002-14: Resistor
  R52 R54: Value: 10k
  R53: Value: 330
SW1 = CMP-10040-000029-1: SWITCH TACTILE SPST-NO 0.02A 15V; Operating Force: 240gf; Switch Travel: 0.13mm; Illumination Type: Non-Illuminated; Throw Configuration: SPST; Number of Ports: 1; Current Rating: 5A; Mechanical Life: 500000Cycles; Switch Function: Off-Mom; Connector Type: USB; Actuator Type: Standard; Gender: Receptacle; Number of Contacts: 24; Contact Plating: Gold; Insulation Color: Black; Min Operating Temperature: -40°C; Packaging: Tape and Reel; Flammability Rating: UL94 V-0; Max Operating Temperature: 85°C; Termination: Solder; Mount: Surface Mount
U6 = CMP-020-00020-2: MCU 32-Bit STM32 ARM Cortex-M4 RISC 512KB Flash 1.71V to 3.6V 64-Pin LQFP T/R; RoHS Compliant: Yes
Y4 = CMP-2000-05733-3: as Y3 on sheet LAN8830_PINOUT; Length: 3.2mm; Depth: 2.5mm; Packaging: Tape and Reel; Min Operating Temperature: -40°C; Operating Frequency: 25 MHz; Lead Free: Lead Free; Number of Pins: 4; Frequency Tolerance: 20ppm; Radiation Hardening: No; Max Operating Temperature: 85°C; Termination: SMD/SMT; Frequency Stability: 30ppm; Frequency: 25MHz; Series: ABM8G; Mount: Surface Mount; Package Quantity: 1000; Height: 0.039inch; Width: 0.098inch; Case/Package: CSMD; ESR (Equivalent Series Resistance): 60R; Load Capacitance: 18pF; Tolerance: 20ppm
Y5 = CMP-40224-000006-1: CRYSTAL 32.7680KHZ 12.5PF SMD; Manufacturer: ECS International; Frequency: 32.768kHz; Esr: 90kΩ; Tolerance: 20ppm; Device Class L1: Passive Components; Load Capacitance: 12.5pF; Temperature: -40°C to +85°C; ComponentLink2URL: https://ecsxtal.com/store/pdf/ECX-1210.pdf; Series: ECX-1210; Octopart: https://octopart.com/ecs-.327-12.5-1210-tr-ecs+international-81221340; ComponentLink2Description: Datasheet; Temperature Range Low: -40°C; Digikey Description: CRYSTAL 32.7680KHZ 12.5PF SMD; Lead Free: Yes; RoHS: TRUE; Device Class L3: Crystals; Automotive: No; Category: Crys; Height: 0.5mm; Manufacturer Part Number: ECS-.327-12.5-1210-TR; Temperature Range High: +85°C; Device Class L2: Crystals / Oscillators; Package: ECX-1210

## Nets that join several sheets
1V1: PHY_1 (FB14_PHY_1.2), PHY_2 (FB14_PHY_2.2), PHY_3 (FB14_PHY_3.2), PHY_4 (FB14_PHY_4.2)
1V2: SJA1105Q_LAN8870_EVB_revA (J14.1), SJA1105Q_PINOUT (FB1.1 FB4.1 FB7.1), REG_1 (C117_REG_1#1.1 C118_REG_1#1.1 R44_REG_1#1.2 U4_REG_1#1.8)
3V3: SJA1105Q_LAN8870_EVB_revA (5 pins), SJA1105Q_PINOUT (14 pins), PHY_1 (5 pins), LAN8830_PINOUT (FB18.1 FB21.1), PHY_2 (5 pins), PHY_3 (5 pins), PHY_4 (5 pins), LM61495Q3_PINOUT (8 pins), REG_1 (5 pins), REG_2 (5 pins), STM32G473RET6_PINOUT (16 pins), REG_3 (5 pins)
8830_1V1: SJA1105Q_LAN8870_EVB_revA (J16.1), LAN8830_PINOUT (FB19.1 FB20.1 FB22.1), REG_2 (C117_REG_1#2.1 C118_REG_1#2.1 R44_REG_1#2.2 U4_REG_1#2.8)
8870_1V1: SJA1105Q_LAN8870_EVB_revA (J18.1), PHY_1 (FB12_PHY_1.1 FB13_PHY_1.1), PHY_2 (FB12_PHY_2.1 FB13_PHY_2.1), PHY_3 (FB12_PHY_3.1 FB13_PHY_3.1), PHY_4 (FB12_PHY_4.1 FB13_PHY_4.1), REG_3 (C117_REG_3.1 C118_REG_3.1 R44_REG_3.2 U4_REG_3.8)
GND: SJA1105Q_LAN8870_EVB_revA (93 pins), SJA1105Q_PINOUT (99 pins), PHY_1 (37 pins), LAN8830_PINOUT (33 pins), PHY_2 (37 pins), PHY_3 (37 pins), PHY_4 (37 pins), LM61495Q3_PINOUT (15 pins), REG_1 (8 pins), REG_2 (8 pins), STM32G473RET6_PINOUT (26 pins), REG_3 (8 pins)
VCC: SJA1105Q_LAN8870_EVB_revA (5 pins), LM61495Q3_PINOUT (7 pins)
3V3_SJA1150Q_MISO: SJA1105Q_LAN8870_EVB_revA (J13.1), SJA1105Q_PINOUT (U1.P4), STM32G473RET6_PINOUT (U6.20)
3V3_SJA1150Q_MOSI: SJA1105Q_LAN8870_EVB_revA (J11.1), SJA1105Q_PINOUT (U1.N5), STM32G473RET6_PINOUT (U6.21)
3V3_SJA1150Q_nCS: SJA1105Q_LAN8870_EVB_revA (J17.1), SJA1105Q_PINOUT (U1.N6), STM32G473RET6_PINOUT (U6.18)
3V3_SJA1150Q_nRST: SJA1105Q_PINOUT (R10.1 U1.P3), STM32G473RET6_PINOUT (U6.22)
3V3_SJA1150Q_SCLK: SJA1105Q_LAN8870_EVB_revA (J15.1), SJA1105Q_PINOUT (U1.P5), STM32G473RET6_PINOUT (U6.19)
LAN8830_CLK125_EN: SJA1105Q_LAN8870_EVB_revA (R64.1), LAN8830_PINOUT (R42.2 U3.34)
LAN8830_MODE0: SJA1105Q_LAN8870_EVB_revA (R59.1), LAN8830_PINOUT (R34.2 U3.33)
LAN8830_MODE1: SJA1105Q_LAN8870_EVB_revA (R60.1), LAN8830_PINOUT (R35.2 U3.32)
LAN8830_MODE2: SJA1105Q_LAN8870_EVB_revA (R61.1), LAN8830_PINOUT (R36.2 U3.30)
LAN8830_MODE3: SJA1105Q_LAN8870_EVB_revA (R62.1), LAN8830_PINOUT (R37.2 U3.29)
LAN8830_MODE4: SJA1105Q_LAN8870_EVB_revA (R63.1), LAN8830_PINOUT (R33.2 U3.36)
LAN8830_PHYAD0: SJA1105Q_LAN8870_EVB_revA (R3.1), LAN8830_PINOUT (R39.2 U3.18)
LAN8830_PHYAD1: SJA1105Q_LAN8870_EVB_revA (R2.1), LAN8830_PINOUT (R32.2 U3.16)
LAN8830_TXRXA_N: SJA1105Q_LAN8870_EVB_revA (D2.2 D2.9 J3.P3), LAN8830_PINOUT (U3.3)
LAN8830_TXRXA_P: SJA1105Q_LAN8870_EVB_revA (D2.1 D2.10 J3.P2), LAN8830_PINOUT (U3.2)
LAN8830_TXRXB_N: SJA1105Q_LAN8870_EVB_revA (D2.5 D2.6 J3.P5), LAN8830_PINOUT (U3.6)
LAN8830_TXRXB_P: SJA1105Q_LAN8870_EVB_revA (D2.4 D2.7 J3.P4), LAN8830_PINOUT (U3.5)
LAN8830_TXRXC_N: SJA1105Q_LAN8870_EVB_revA (D3.2 D3.9 J3.P8), LAN8830_PINOUT (U3.8)
LAN8830_TXRXC_P: SJA1105Q_LAN8870_EVB_revA (D3.1 D3.10 J3.P7), LAN8830_PINOUT (U3.7)
LAN8830_TXRXD_N: SJA1105Q_LAN8870_EVB_revA (D3.5 D3.6 J3.P10), LAN8830_PINOUT (U3.11)
LAN8830_TXRXD_P: SJA1105Q_LAN8870_EVB_revA (D3.4 D3.7 J3.P9), LAN8830_PINOUT (U3.10)
LAN8870_RX_CLK: SJA1105Q_LAN8870_EVB_revA (R75.2), PHY_4 (U2_PHY_4.16)
LAN8870_RX_CLK: SJA1105Q_PINOUT (U1.B6), PHY_1 (U2_PHY_1.16)
LAN8870_RX_CLK: SJA1105Q_PINOUT (U1.B14), PHY_2 (U2_PHY_2.16)
LAN8870_RX_CLK: SJA1105Q_PINOUT (U1.J13), PHY_3 (U2_PHY_3.16)
LAN8870_RXCTL: SJA1105Q_LAN8870_EVB_revA (R76.2), PHY_4 (R18_PHY_4.2 U2_PHY_4.17)
LAN8870_RXCTL: SJA1105Q_PINOUT (U1.A4), PHY_1 (R18_PHY_1.2 U2_PHY_1.17)
LAN8870_RXCTL: SJA1105Q_PINOUT (U1.A11), PHY_2 (R18_PHY_2.2 U2_PHY_2.17)
LAN8870_RXCTL: SJA1105Q_PINOUT (U1.G14), PHY_3 (R18_PHY_3.2 U2_PHY_3.17)
LAN8870_RXD0: SJA1105Q_LAN8870_EVB_revA (R71.2), PHY_4 (R22_PHY_4.1 U2_PHY_4.11)
LAN8870_RXD0: SJA1105Q_PINOUT (U1.A6), PHY_1 (R22_PHY_1.1 U2_PHY_1.11)
LAN8870_RXD0: SJA1105Q_PINOUT (U1.A13), PHY_2 (R22_PHY_2.1 U2_PHY_2.11)
LAN8870_RXD0: SJA1105Q_PINOUT (U1.J14), PHY_3 (R22_PHY_3.1 U2_PHY_3.11)
LAN8870_RXD1: SJA1105Q_LAN8870_EVB_revA (R72.2), PHY_4 (R20_PHY_4.1 U2_PHY_4.12)
LAN8870_RXD1: SJA1105Q_PINOUT (U1.B5), PHY_1 (R20_PHY_1.1 U2_PHY_1.12)
LAN8870_RXD1: SJA1105Q_PINOUT (U1.B12), PHY_2 (R20_PHY_2.1 U2_PHY_2.12)
LAN8870_RXD1: SJA1105Q_PINOUT (U1.H13), PHY_3 (R20_PHY_3.1 U2_PHY_3.12)
LAN8870_RXD2: SJA1105Q_LAN8870_EVB_revA (R73.2), PHY_4 (R19_PHY_4.1 U2_PHY_4.14)
LAN8870_RXD2: SJA1105Q_PINOUT (U1.A5), PHY_1 (R19_PHY_1.1 U2_PHY_1.14)
LAN8870_RXD2: SJA1105Q_PINOUT (U1.A12), PHY_2 (R19_PHY_2.1 U2_PHY_2.14)
LAN8870_RXD2: SJA1105Q_PINOUT (U1.H14), PHY_3 (R19_PHY_3.1 U2_PHY_3.14)
LAN8870_RXD3: SJA1105Q_LAN8870_EVB_revA (R74.2), PHY_4 (R26_PHY_4.2 U2_PHY_4.15)
LAN8870_RXD3: SJA1105Q_PINOUT (U1.B4), PHY_1 (R26_PHY_1.2 U2_PHY_1.15)
LAN8870_RXD3: SJA1105Q_PINOUT (U1.B11), PHY_2 (R26_PHY_2.2 U2_PHY_2.15)
LAN8870_RXD3: SJA1105Q_PINOUT (U1.G13), PHY_3 (R26_PHY_3.2 U2_PHY_3.15)
LAN8870_TX_CLK: SJA1105Q_LAN8870_EVB_revA (R69.2), PHY_4 (U2_PHY_4.23)
LAN8870_TX_CLK: SJA1105Q_PINOUT (U1.A7), PHY_1 (U2_PHY_1.23)
LAN8870_TX_CLK: SJA1105Q_PINOUT (U1.C14), PHY_2 (U2_PHY_2.23)
LAN8870_TX_CLK: SJA1105Q_PINOUT (U1.K14), PHY_3 (U2_PHY_3.23)
LAN8870_TX_CTL: SJA1105Q_LAN8870_EVB_revA (R70.2), PHY_4 (U2_PHY_4.24)
LAN8870_TX_CTL: SJA1105Q_PINOUT (U1.B7), PHY_1 (U2_PHY_1.24)
LAN8870_TX_CTL: SJA1105Q_PINOUT (U1.C13), PHY_2 (U2_PHY_2.24)
LAN8870_TX_CTL: SJA1105Q_PINOUT (U1.K13), PHY_3 (U2_PHY_3.24)
LAN8870_TXD0: SJA1105Q_LAN8870_EVB_revA (R65.2), PHY_4 (U2_PHY_4.25)
LAN8870_TXD0: SJA1105Q_PINOUT (U1.B9), PHY_1 (U2_PHY_1.25)
LAN8870_TXD0: SJA1105Q_PINOUT (U1.E13), PHY_2 (U2_PHY_2.25)
LAN8870_TXD0: SJA1105Q_PINOUT (U1.M13), PHY_3 (U2_PHY_3.25)
LAN8870_TXD1: SJA1105Q_LAN8870_EVB_revA (R66.2), PHY_4 (U2_PHY_4.26)
LAN8870_TXD1: SJA1105Q_PINOUT (U1.A9), PHY_1 (U2_PHY_1.26)
LAN8870_TXD1: SJA1105Q_PINOUT (U1.E14), PHY_2 (U2_PHY_2.26)
LAN8870_TXD1: SJA1105Q_PINOUT (U1.M14), PHY_3 (U2_PHY_3.26)
LAN8870_TXD2: SJA1105Q_LAN8870_EVB_revA (R67.2), PHY_4 (U2_PHY_4.27)
LAN8870_TXD2: SJA1105Q_PINOUT (U1.B8), PHY_1 (U2_PHY_1.27)
LAN8870_TXD2: SJA1105Q_PINOUT (U1.D13), PHY_2 (U2_PHY_2.27)
LAN8870_TXD2: SJA1105Q_PINOUT (U1.L13), PHY_3 (U2_PHY_3.27)
LAN8870_TXD3: SJA1105Q_LAN8870_EVB_revA (R68.2), PHY_4 (U2_PHY_4.28)
LAN8870_TXD3: SJA1105Q_PINOUT (U1.A8), PHY_1 (U2_PHY_1.28)
LAN8870_TXD3: SJA1105Q_PINOUT (U1.D14), PHY_2 (U2_PHY_2.28)
LAN8870_TXD3: SJA1105Q_PINOUT (U1.L14), PHY_3 (U2_PHY_3.28)
NetR38_1: SJA1105Q_LAN8870_EVB_revA (R38.1), LAN8830_PINOUT (U3.19)
NetR38_2: SJA1105Q_LAN8870_EVB_revA (R38.2), SJA1105Q_PINOUT (U1.A2)
NetR40_1: SJA1105Q_LAN8870_EVB_revA (R40.1), LAN8830_PINOUT (U3.20)
NetR40_2: SJA1105Q_LAN8870_EVB_revA (R40.2), SJA1105Q_PINOUT (U1.B1)
NetR55_1: SJA1105Q_LAN8870_EVB_revA (R55.1), LAN8830_PINOUT (U3.21)
NetR55_2: SJA1105Q_LAN8870_EVB_revA (R55.2), SJA1105Q_PINOUT (U1.C2)
NetR56_1: SJA1105Q_LAN8870_EVB_revA (R56.1), LAN8830_PINOUT (U3.22)
NetR56_2: SJA1105Q_LAN8870_EVB_revA (R56.2), SJA1105Q_PINOUT (U1.C1)
NetR57_1: SJA1105Q_LAN8870_EVB_revA (R57.1), LAN8830_PINOUT (U3.25)
NetR57_2: SJA1105Q_LAN8870_EVB_revA (R57.2), SJA1105Q_PINOUT (U1.D1)
NetR58_1: SJA1105Q_LAN8870_EVB_revA (R58.1), LAN8830_PINOUT (U3.26)
NetR58_2: SJA1105Q_LAN8870_EVB_revA (R58.2), SJA1105Q_PINOUT (U1.D2)
NetR59_2: SJA1105Q_LAN8870_EVB_revA (R59.2), SJA1105Q_PINOUT (U1.E1)
NetR60_2: SJA1105Q_LAN8870_EVB_revA (R60.2), SJA1105Q_PINOUT (U1.F2)
NetR61_2: SJA1105Q_LAN8870_EVB_revA (R61.2), SJA1105Q_PINOUT (U1.F1)
NetR62_2: SJA1105Q_LAN8870_EVB_revA (R62.2), SJA1105Q_PINOUT (U1.G2)
NetR63_2: SJA1105Q_LAN8870_EVB_revA (R63.2), SJA1105Q_PINOUT (U1.E2)
NetR64_2: SJA1105Q_LAN8870_EVB_revA (R64.2), SJA1105Q_PINOUT (U1.G1)
NetR65_1: SJA1105Q_LAN8870_EVB_revA (R65.1), SJA1105Q_PINOUT (U1.P7)
NetR66_1: SJA1105Q_LAN8870_EVB_revA (R66.1), SJA1105Q_PINOUT (U1.N7)
NetR67_1: SJA1105Q_LAN8870_EVB_revA (R67.1), SJA1105Q_PINOUT (U1.P8)
NetR68_1: SJA1105Q_LAN8870_EVB_revA (R68.1), SJA1105Q_PINOUT (U1.N8)
NetR69_1: SJA1105Q_LAN8870_EVB_revA (R69.1), SJA1105Q_PINOUT (U1.N9)
NetR70_1: SJA1105Q_LAN8870_EVB_revA (R70.1), SJA1105Q_PINOUT (U1.P9)
NetR71_1: SJA1105Q_LAN8870_EVB_revA (R71.1), SJA1105Q_PINOUT (U1.N10)
NetR72_1: SJA1105Q_LAN8870_EVB_revA (R72.1), SJA1105Q_PINOUT (U1.P11)
NetR73_1: SJA1105Q_LAN8870_EVB_revA (R73.1), SJA1105Q_PINOUT (U1.N11)
NetR74_1: SJA1105Q_LAN8870_EVB_revA (R74.1), SJA1105Q_PINOUT (U1.P12)
NetR75_1: SJA1105Q_LAN8870_EVB_revA (R75.1), SJA1105Q_PINOUT (U1.P10)
NetR76_1: SJA1105Q_LAN8870_EVB_revA (R76.1), SJA1105Q_PINOUT (U1.N12)
P1_TRX_N: SJA1105Q_LAN8870_EVB_revA (D4.4 D4.7 J4.1), PHY_1 (C65_PHY_1.2 R11_PHY_1.2)
P1_TRX_P: SJA1105Q_LAN8870_EVB_revA (D4.2 D4.9 J4.2), PHY_1 (C64_PHY_1.2 R12_PHY_1.2)
P2_TRX_N: SJA1105Q_LAN8870_EVB_revA (D5.4 D5.7 J5.1), PHY_2 (C65_PHY_2.2 R11_PHY_2.2)
P2_TRX_P: SJA1105Q_LAN8870_EVB_revA (D5.2 D5.9 J5.2), PHY_2 (C64_PHY_2.2 R12_PHY_2.2)
P3_TRX_N: SJA1105Q_LAN8870_EVB_revA (D6.4 D6.7 J6.1), PHY_3 (C65_PHY_3.2 R11_PHY_3.2)
P3_TRX_P: SJA1105Q_LAN8870_EVB_revA (D6.2 D6.9 J6.2), PHY_3 (C64_PHY_3.2 R12_PHY_3.2)
P4_TRX_N: SJA1105Q_LAN8870_EVB_revA (D7.4 D7.7 J7.1), PHY_4 (C65_PHY_4.2 R11_PHY_4.2)
P4_TRX_P: SJA1105Q_LAN8870_EVB_revA (D7.2 D7.9 J7.2), PHY_4 (C64_PHY_4.2 R12_PHY_4.2)
STM32_G_LED: SJA1105Q_LAN8870_EVB_revA (D10.1), STM32G473RET6_PINOUT (U6.61)
STM32_R_LED: SJA1105Q_LAN8870_EVB_revA (D10.4), STM32G473RET6_PINOUT (U6.62)